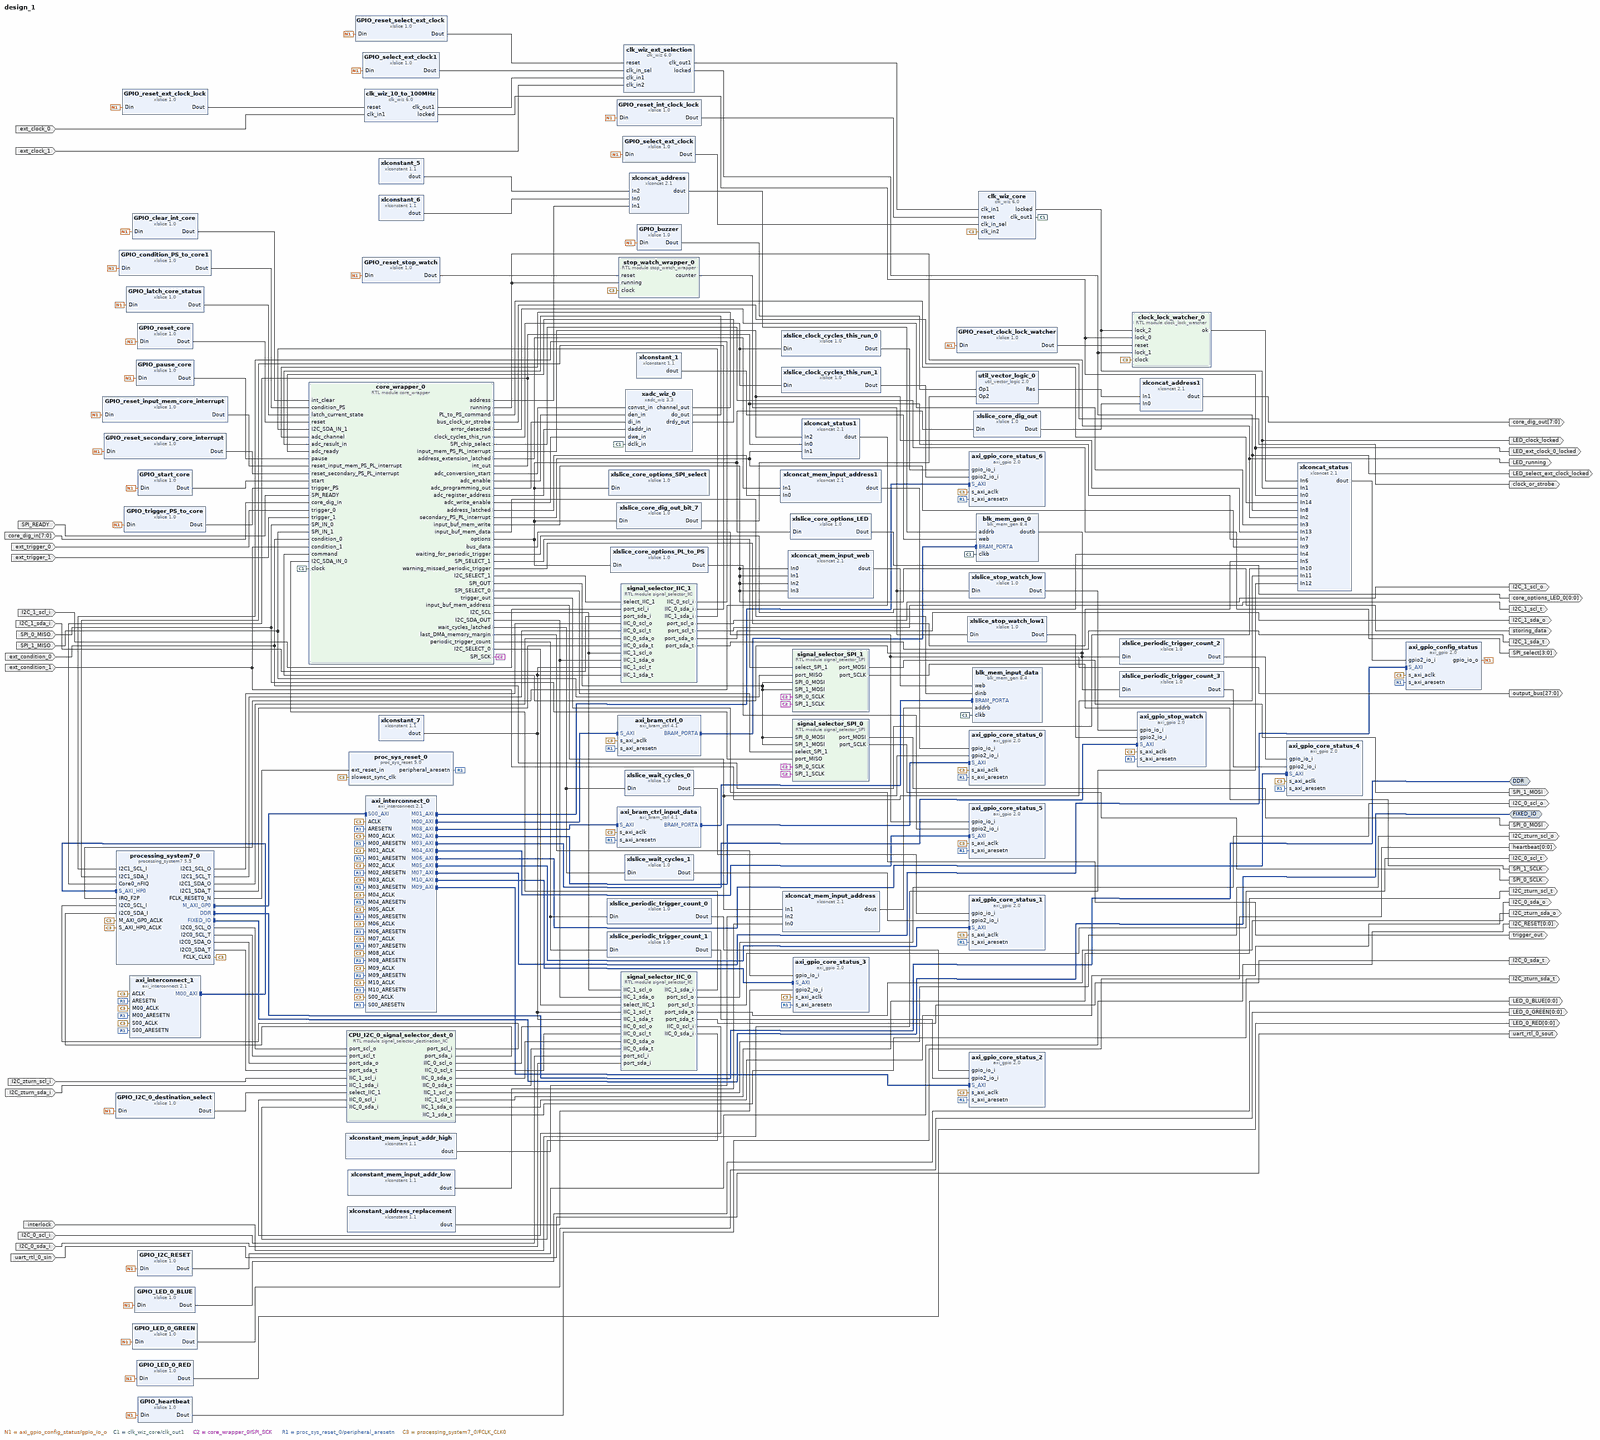
[diagram p0: block diagram of the top level, whole]
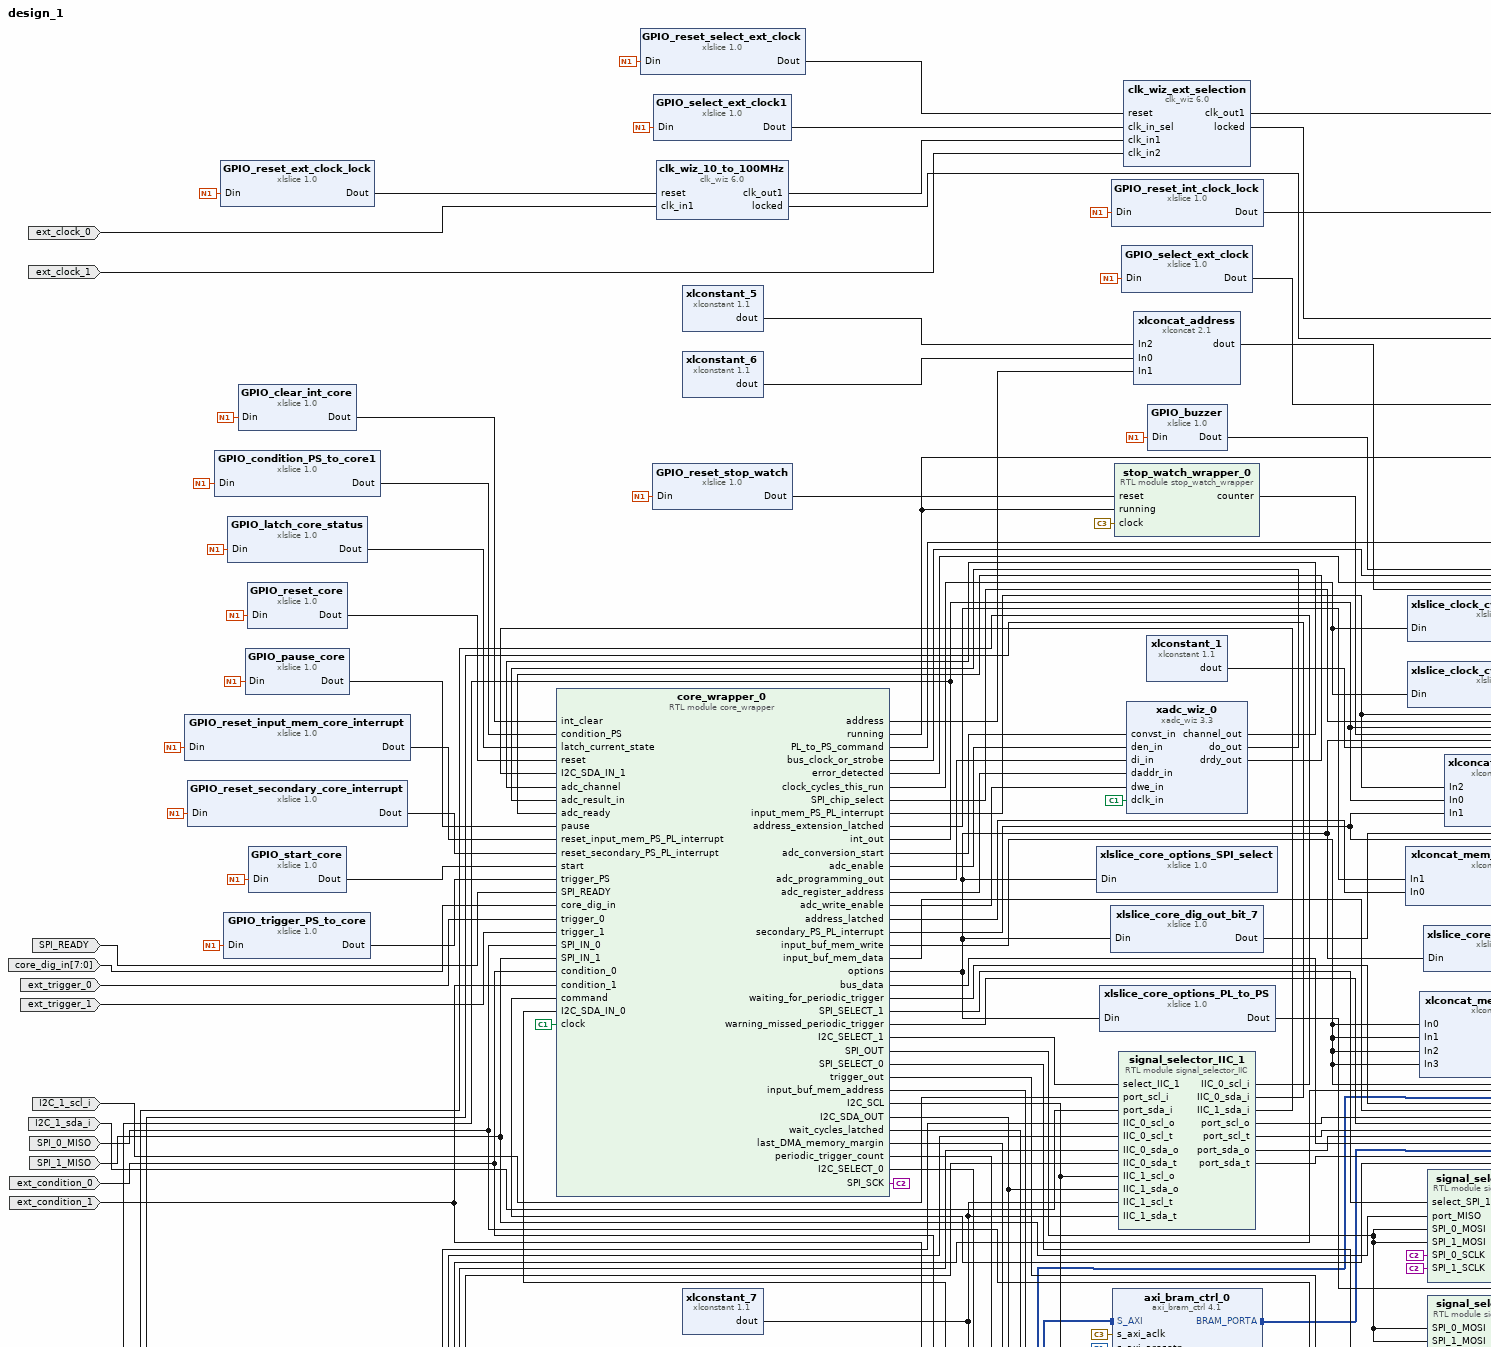
[diagram p1: block diagram of the top level, upper left part]
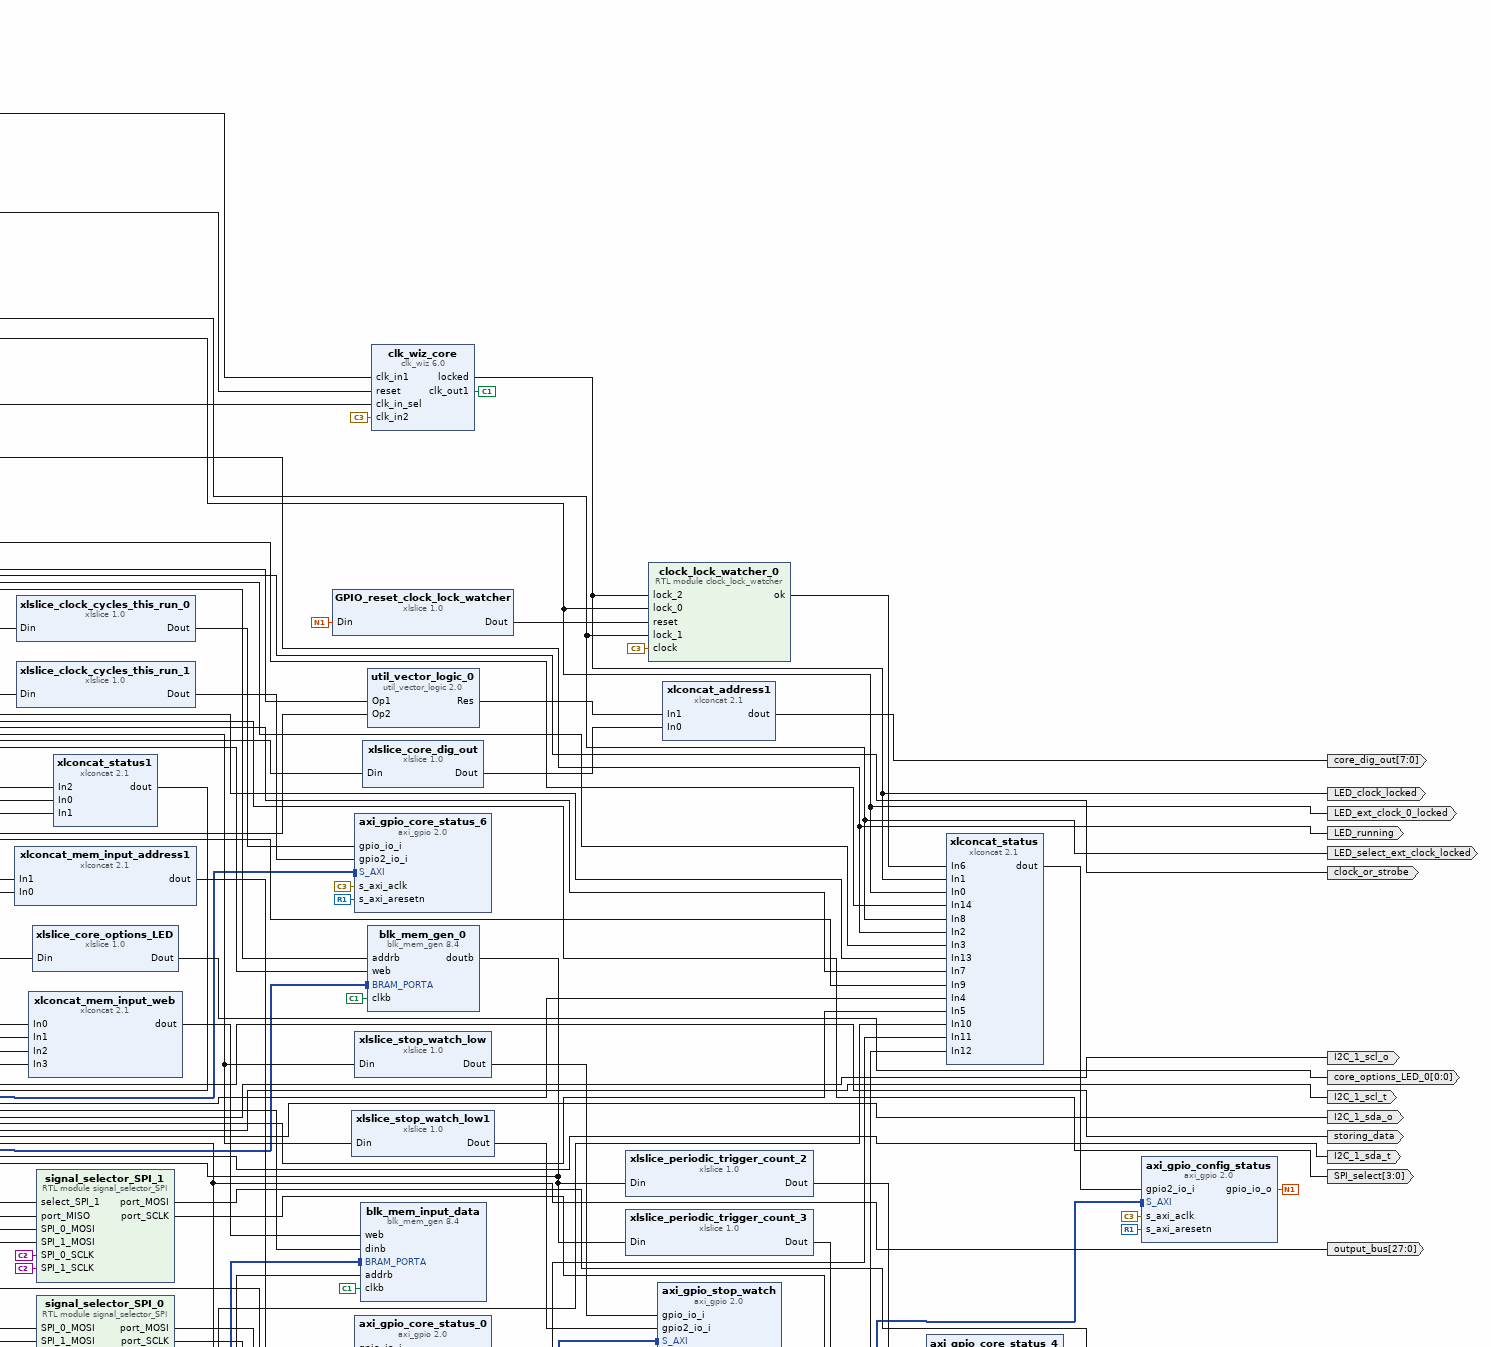
[diagram p2: block diagram of the top level, upper right part]
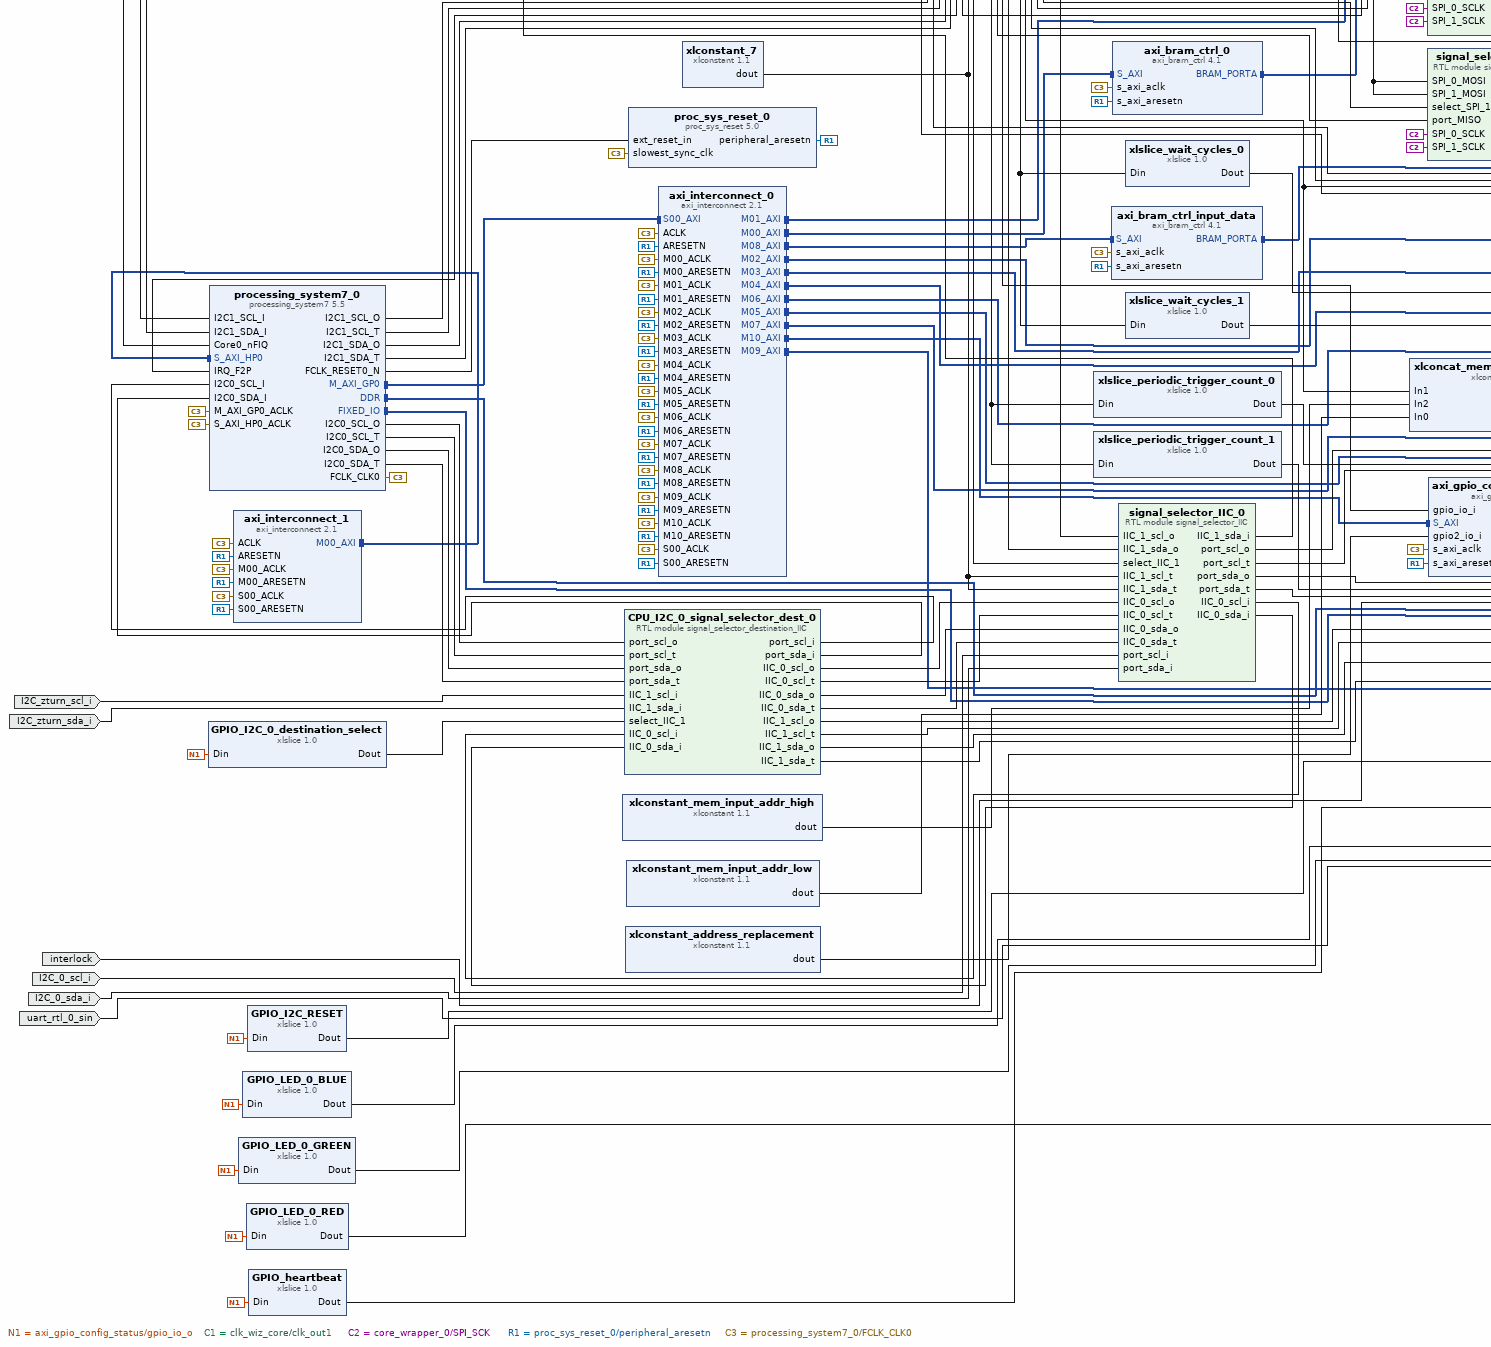
[diagram p3: block diagram of the top level, lower left part]
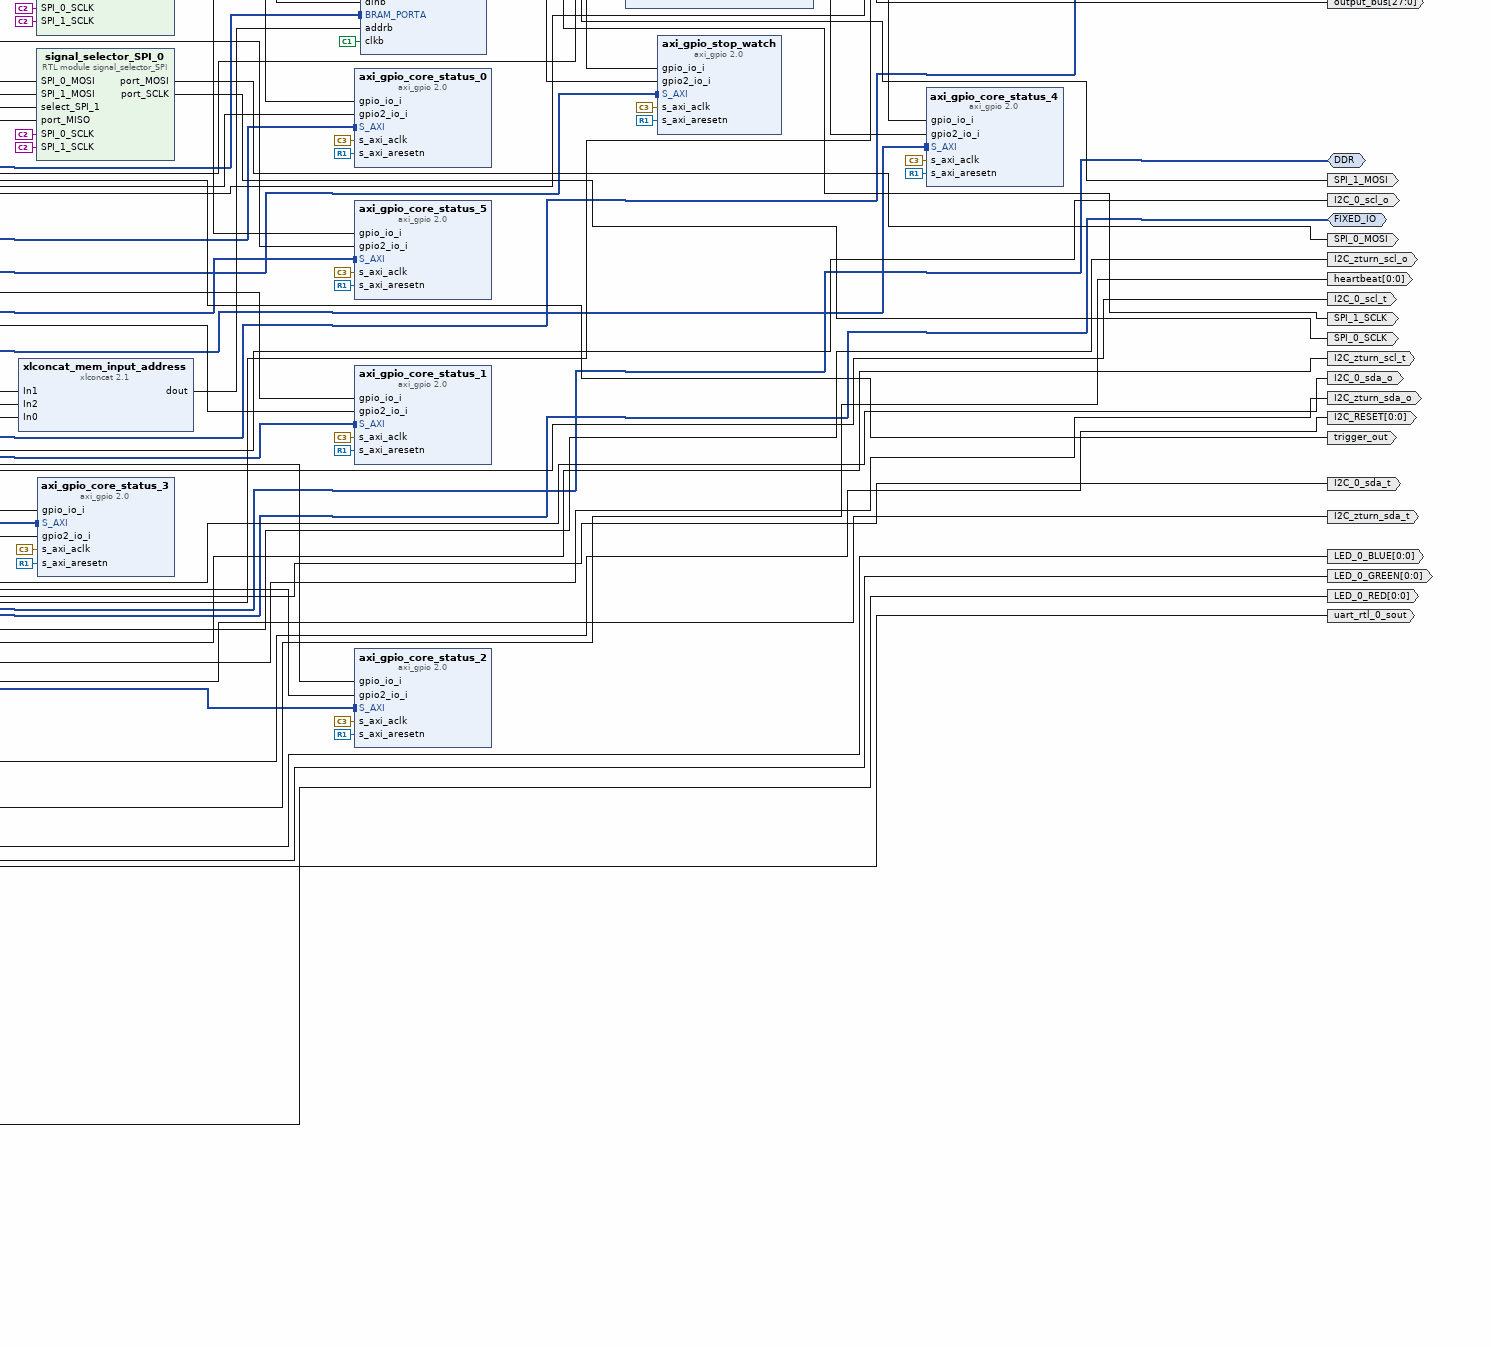
[diagram p4: block diagram of the top level, lower right part]
# Vivado block design design_1, xc7z020clg400-1, Vivado 2023.1
create_bd_design design_1

create_bd_intf_port -mode Master -vlnv xilinx.com:interface:ddrx_rtl:1.0 DDR
create_bd_intf_port -mode Master -vlnv xilinx.com:display_processing_system7:fixedio_rtl:1.0 FIXED_IO
create_bd_port -dir O -from 27 -to 0 output_bus
create_bd_port -dir O clock_or_strobe
create_bd_port -dir I ext_clock_0
create_bd_port -dir I ext_trigger_0
create_bd_port -dir I ext_trigger_1
create_bd_port -dir I ext_condition_0
create_bd_port -dir I ext_condition_1
create_bd_port -dir O I2C_1_scl_o
create_bd_port -dir O I2C_1_scl_t
create_bd_port -dir I I2C_1_scl_i
create_bd_port -dir O I2C_1_sda_o
create_bd_port -dir O I2C_1_sda_t
create_bd_port -dir I I2C_1_sda_i
create_bd_port -dir O I2C_0_scl_o
create_bd_port -dir O I2C_0_scl_t
create_bd_port -dir I I2C_0_scl_i
create_bd_port -dir O I2C_0_sda_o
create_bd_port -dir O I2C_0_sda_t
create_bd_port -dir I I2C_0_sda_i
create_bd_port -dir O SPI_0_MOSI
create_bd_port -dir O SPI_0_SCLK
create_bd_port -dir I SPI_0_MISO
create_bd_port -dir I SPI_1_MISO
create_bd_port -dir O SPI_1_MOSI
create_bd_port -dir O SPI_1_SCLK
create_bd_port -dir O LED_running
create_bd_port -dir O LED_ext_clock_0_locked
create_bd_port -dir O LED_clock_locked
create_bd_port -dir O trigger_out
create_bd_port -dir O -from 3 -to 0 SPI_select
create_bd_port -dir O -from 0 -to 0 core_options_LED_0
create_bd_port -dir O -from 0 -to 0 LED_0_RED
create_bd_port -dir O -from 0 -to 0 LED_0_GREEN
create_bd_port -dir O -from 0 -to 0 LED_0_BLUE
create_bd_port -dir O -from 0 -to 0 I2C_RESET
create_bd_port -dir I -type clk ext_clock_1
set_property -dict [list \
  CONFIG.CLK_DOMAIN design_1_processing_system7_0_0_FCLK_CLK0 \
  CONFIG.FREQ_HZ 100000000 \
] [get_bd_ports ext_clock_1]
create_bd_port -dir O LED_select_ext_clock_locked
create_bd_port -dir I -from 7 -to 0 core_dig_in
create_bd_port -dir O -from 7 -to 0 core_dig_out
create_bd_port -dir I interlock
create_bd_port -dir O storing_data
create_bd_port -dir O uart_rtl_0_sout
create_bd_port -dir I uart_rtl_0_sin
create_bd_port -dir I SPI_READY
create_bd_port -dir O -from 0 -to 0 -type data heartbeat
create_bd_port -dir I -type data I2C_zturn_sda_i
create_bd_port -dir I -type data I2C_zturn_scl_i
create_bd_port -dir O -type data I2C_zturn_sda_t
create_bd_port -dir O I2C_zturn_scl_t
create_bd_port -dir O I2C_zturn_sda_o
create_bd_port -dir O I2C_zturn_scl_o

create_bd_cell -type ip -vlnv xilinx.com:ip:axi_interconnect:2.1 axi_interconnect_0
set_property -dict {CONFIG.NUM_MI 11} [get_bd_cells axi_interconnect_0]
create_bd_cell -type ip -vlnv xilinx.com:ip:blk_mem_gen:8.4 blk_mem_gen_0
set_property -dict [list \
  CONFIG.Assume_Synchronous_Clk false \
  CONFIG.Enable_32bit_Address true \
  CONFIG.Enable_A Use_ENA_Pin \
  CONFIG.Enable_B Always_Enabled \
  CONFIG.Memory_Type True_Dual_Port_RAM \
  CONFIG.Operating_Mode_B WRITE_FIRST \
  CONFIG.Read_Width_A 64 \
  CONFIG.Register_PortA_Output_of_Memory_Primitives false \
  CONFIG.Register_PortB_Output_of_Memory_Primitives false \
  CONFIG.Use_RSTA_Pin false \
  CONFIG.Use_RSTB_Pin false \
  CONFIG.Write_Depth_A 65536 \
  CONFIG.Write_Width_A 64 \
  CONFIG.use_bram_block Stand_Alone \
] [get_bd_cells blk_mem_gen_0]
create_bd_cell -type ip -vlnv xilinx.com:ip:axi_bram_ctrl:4.1 axi_bram_ctrl_0
set_property -dict {CONFIG.DATA_WIDTH 64 CONFIG.SINGLE_PORT_BRAM 1} [get_bd_cells axi_bram_ctrl_0]
create_bd_cell -type ip -vlnv xilinx.com:ip:xlconstant:1.1 xlconstant_1
set_property -dict {CONFIG.CONST_VAL 0 CONFIG.CONST_WIDTH 8} [get_bd_cells xlconstant_1]
create_bd_cell -type ip -vlnv xilinx.com:ip:xlslice:1.0 GPIO_reset_core
set_property -dict {CONFIG.DIN_FROM 3 CONFIG.DIN_TO 3 CONFIG.DIN_WIDTH 32} [get_bd_cells GPIO_reset_core]
create_bd_cell -type ip -vlnv xilinx.com:ip:xlslice:1.0 GPIO_start_core
set_property -dict {CONFIG.DIN_FROM 4 CONFIG.DIN_TO 4 CONFIG.DIN_WIDTH 32} [get_bd_cells GPIO_start_core]
create_bd_cell -type ip -vlnv xilinx.com:ip:xlslice:1.0 GPIO_clear_int_core
set_property -dict {CONFIG.DIN_FROM 6 CONFIG.DIN_TO 6 CONFIG.DIN_WIDTH 32} [get_bd_cells GPIO_clear_int_core]
create_bd_cell -type ip -vlnv xilinx.com:ip:xlslice:1.0 GPIO_pause_core
set_property -dict {CONFIG.DIN_FROM 5 CONFIG.DIN_TO 5 CONFIG.DIN_WIDTH 32} [get_bd_cells GPIO_pause_core]
create_bd_cell -type ip -vlnv xilinx.com:ip:xlslice:1.0 GPIO_reset_ext_clock_lock
set_property -dict {CONFIG.DIN_FROM 0 CONFIG.DIN_TO 0 CONFIG.DIN_WIDTH 32} [get_bd_cells GPIO_reset_ext_clock_lock]
create_bd_cell -type ip -vlnv xilinx.com:ip:xlslice:1.0 GPIO_reset_int_clock_lock
set_property -dict {CONFIG.DIN_FROM 1 CONFIG.DIN_TO 1 CONFIG.DIN_WIDTH 32} [get_bd_cells GPIO_reset_int_clock_lock]
create_bd_cell -type ip -vlnv xilinx.com:ip:xlslice:1.0 GPIO_select_ext_clock
set_property -dict {CONFIG.DIN_FROM 8 CONFIG.DIN_TO 8 CONFIG.DIN_WIDTH 32} [get_bd_cells GPIO_select_ext_clock]
create_bd_cell -type ip -vlnv xilinx.com:ip:xlconcat:2.1 xlconcat_status
set_property -dict [list \
  CONFIG.IN0_WIDTH 1 \
  CONFIG.IN10_WIDTH 1 \
  CONFIG.IN11_WIDTH 1 \
  CONFIG.IN12_WIDTH 1 \
  CONFIG.IN13_WIDTH 1 \
  CONFIG.IN14_WIDTH 16 \
  CONFIG.IN1_WIDTH 1 \
  CONFIG.IN2_WIDTH 1 \
  CONFIG.IN3_WIDTH 1 \
  CONFIG.IN4_WIDTH 1 \
  CONFIG.IN5_WIDTH 1 \
  CONFIG.IN6_WIDTH 3 \
  CONFIG.IN7_WIDTH 1 \
  CONFIG.IN8_WIDTH 1 \
  CONFIG.IN9_WIDTH 1 \
  CONFIG.NUM_PORTS 15 \
] [get_bd_cells xlconcat_status]
create_bd_cell -type ip -vlnv xilinx.com:ip:xlslice:1.0 GPIO_latch_core_status
set_property -dict {CONFIG.DIN_FROM 7 CONFIG.DIN_TO 7 CONFIG.DIN_WIDTH 32} [get_bd_cells GPIO_latch_core_status]
create_bd_cell -type ip -vlnv xilinx.com:ip:xlslice:1.0 xlslice_wait_cycles_0
set_property -dict {CONFIG.DIN_FROM 31 CONFIG.DIN_TO 0 CONFIG.DIN_WIDTH 48} [get_bd_cells xlslice_wait_cycles_0]
create_bd_cell -type ip -vlnv xilinx.com:ip:xlslice:1.0 xlslice_wait_cycles_1
set_property -dict {CONFIG.DIN_FROM 47 CONFIG.DIN_TO 32 CONFIG.DIN_WIDTH 48} [get_bd_cells xlslice_wait_cycles_1]
create_bd_cell -type ip -vlnv xilinx.com:ip:blk_mem_gen:8.4 blk_mem_input_data
set_property -dict [list \
  CONFIG.Enable_32bit_Address true \
  CONFIG.Enable_B Always_Enabled \
  CONFIG.Memory_Type True_Dual_Port_RAM \
  CONFIG.Register_PortA_Output_of_Memory_Primitives false \
  CONFIG.Register_PortB_Output_of_Memory_Primitives false \
  CONFIG.Use_RSTA_Pin false \
  CONFIG.Use_RSTB_Pin false \
  CONFIG.Write_Depth_A 8192 \
  CONFIG.use_bram_block Stand_Alone \
] [get_bd_cells blk_mem_input_data]
create_bd_cell -type ip -vlnv xilinx.com:ip:axi_bram_ctrl:4.1 axi_bram_ctrl_input_data
set_property -dict {CONFIG.SINGLE_PORT_BRAM 1} [get_bd_cells axi_bram_ctrl_input_data]
create_bd_cell -type ip -vlnv xilinx.com:ip:xlslice:1.0 xlslice_periodic_trigger_count_0
set_property -dict {CONFIG.DIN_FROM 31 CONFIG.DIN_TO 0 CONFIG.DIN_WIDTH 48} [get_bd_cells xlslice_periodic_trigger_count_0]
create_bd_cell -type ip -vlnv xilinx.com:ip:xlslice:1.0 xlslice_periodic_trigger_count_1
set_property -dict {CONFIG.DIN_FROM 47 CONFIG.DIN_TO 32 CONFIG.DIN_WIDTH 48} [get_bd_cells xlslice_periodic_trigger_count_1]
create_bd_cell -type ip -vlnv xilinx.com:ip:xlslice:1.0 GPIO_reset_clock_lock_watcher
set_property -dict {CONFIG.DIN_FROM 2 CONFIG.DIN_TO 2 CONFIG.DIN_WIDTH 32} [get_bd_cells GPIO_reset_clock_lock_watcher]
create_bd_cell -type ip -vlnv xilinx.com:ip:xlconcat:2.1 xlconcat_address
set_property -dict [list \
  CONFIG.IN0_WIDTH 3 \
  CONFIG.IN1_WIDTH 16 \
  CONFIG.IN2_WIDTH 13 \
  CONFIG.IN3_WIDTH 54 \
  CONFIG.NUM_PORTS 3 \
] [get_bd_cells xlconcat_address]
create_bd_cell -type ip -vlnv xilinx.com:ip:xlconstant:1.1 xlconstant_5
set_property -dict {CONFIG.CONST_VAL 0 CONFIG.CONST_WIDTH 13} [get_bd_cells xlconstant_5]
create_bd_cell -type ip -vlnv xilinx.com:ip:xlconstant:1.1 xlconstant_6
set_property -dict {CONFIG.CONST_VAL 0 CONFIG.CONST_WIDTH 3} [get_bd_cells xlconstant_6]
create_bd_cell -type ip -vlnv xilinx.com:ip:xlslice:1.0 xlslice_periodic_trigger_count_2
set_property -dict {CONFIG.DIN_FROM 31 CONFIG.DIN_TO 0 CONFIG.DIN_WIDTH 64} [get_bd_cells xlslice_periodic_trigger_count_2]
create_bd_cell -type ip -vlnv xilinx.com:ip:xlslice:1.0 xlslice_periodic_trigger_count_3
set_property -dict {CONFIG.DIN_FROM 63 CONFIG.DIN_TO 32 CONFIG.DIN_WIDTH 64} [get_bd_cells xlslice_periodic_trigger_count_3]
create_bd_cell -type ip -vlnv xilinx.com:ip:xlslice:1.0 xlslice_clock_cycles_this_run_0
set_property -dict {CONFIG.DIN_FROM 31 CONFIG.DIN_TO 0 CONFIG.DIN_WIDTH 48} [get_bd_cells xlslice_clock_cycles_this_run_0]
create_bd_cell -type ip -vlnv xilinx.com:ip:xlslice:1.0 xlslice_clock_cycles_this_run_1
set_property -dict {CONFIG.DIN_FROM 47 CONFIG.DIN_TO 32 CONFIG.DIN_WIDTH 48} [get_bd_cells xlslice_clock_cycles_this_run_1]
create_bd_cell -type ip -vlnv xilinx.com:ip:xlslice:1.0 xlslice_core_options_PL_to_PS
set_property -dict {CONFIG.DIN_FROM 31 CONFIG.DIN_TO 24 CONFIG.DIN_WIDTH 32} [get_bd_cells xlslice_core_options_PL_to_PS]
create_bd_cell -type ip -vlnv xilinx.com:ip:xlslice:1.0 GPIO_trigger_PS_to_core
set_property -dict {CONFIG.DIN_FROM 9 CONFIG.DIN_TO 9 CONFIG.DIN_WIDTH 32} [get_bd_cells GPIO_trigger_PS_to_core]
create_bd_cell -type ip -vlnv xilinx.com:ip:xlslice:1.0 GPIO_condition_PS_to_core1
set_property -dict {CONFIG.DIN_FROM 10 CONFIG.DIN_TO 10 CONFIG.DIN_WIDTH 32} [get_bd_cells GPIO_condition_PS_to_core1]
create_bd_cell -type module -reference stop_watch_wrapper stop_watch_wrapper_0
create_bd_cell -type ip -vlnv xilinx.com:ip:xlslice:1.0 GPIO_reset_stop_watch
set_property -dict {CONFIG.DIN_FROM 11 CONFIG.DIN_TO 11 CONFIG.DIN_WIDTH 32} [get_bd_cells GPIO_reset_stop_watch]
create_bd_cell -type ip -vlnv xilinx.com:ip:xlslice:1.0 xlslice_stop_watch_low
set_property -dict {CONFIG.DIN_FROM 31 CONFIG.DIN_TO 0 CONFIG.DIN_WIDTH 48} [get_bd_cells xlslice_stop_watch_low]
create_bd_cell -type ip -vlnv xilinx.com:ip:xlslice:1.0 xlslice_stop_watch_low1
set_property -dict {CONFIG.DIN_FROM 47 CONFIG.DIN_TO 32 CONFIG.DIN_WIDTH 48} [get_bd_cells xlslice_stop_watch_low1]
create_bd_cell -type ip -vlnv xilinx.com:ip:xlslice:1.0 GPIO_LED_0_RED
set_property -dict {CONFIG.DIN_FROM 12 CONFIG.DIN_TO 12 CONFIG.DIN_WIDTH 32} [get_bd_cells GPIO_LED_0_RED]
create_bd_cell -type ip -vlnv xilinx.com:ip:xlslice:1.0 GPIO_LED_0_GREEN
set_property -dict {CONFIG.DIN_FROM 13 CONFIG.DIN_TO 13 CONFIG.DIN_WIDTH 32} [get_bd_cells GPIO_LED_0_GREEN]
create_bd_cell -type ip -vlnv xilinx.com:ip:xlslice:1.0 GPIO_LED_0_BLUE
set_property -dict {CONFIG.DIN_FROM 14 CONFIG.DIN_TO 14 CONFIG.DIN_WIDTH 32} [get_bd_cells GPIO_LED_0_BLUE]
create_bd_cell -type ip -vlnv xilinx.com:ip:xlslice:1.0 xlslice_core_options_LED
set_property -dict {CONFIG.DIN_FROM 0 CONFIG.DIN_TO 0 CONFIG.DIN_WIDTH 32} [get_bd_cells xlslice_core_options_LED]
create_bd_cell -type ip -vlnv xilinx.com:ip:xlslice:1.0 GPIO_I2C_RESET
set_property -dict {CONFIG.DIN_FROM 15 CONFIG.DIN_TO 15 CONFIG.DIN_WIDTH 32} [get_bd_cells GPIO_I2C_RESET]
create_bd_cell -type ip -vlnv xilinx.com:ip:xlslice:1.0 xlslice_core_options_SPI_select
set_property -dict {CONFIG.DIN_FROM 4 CONFIG.DIN_TO 1 CONFIG.DIN_WIDTH 32} [get_bd_cells xlslice_core_options_SPI_select]
create_bd_cell -type ip -vlnv xilinx.com:ip:xlconstant:1.1 xlconstant_7
set_property -dict {CONFIG.CONST_VAL 0 CONFIG.CONST_WIDTH 1} [get_bd_cells xlconstant_7]
create_bd_cell -type ip -vlnv xilinx.com:ip:xlslice:1.0 GPIO_select_ext_clock1
set_property -dict {CONFIG.DIN_FROM 16 CONFIG.DIN_TO 16 CONFIG.DIN_WIDTH 32} [get_bd_cells GPIO_select_ext_clock1]
create_bd_cell -type ip -vlnv xilinx.com:ip:xlslice:1.0 GPIO_reset_select_ext_clock
set_property -dict {CONFIG.DIN_FROM 17 CONFIG.DIN_TO 17 CONFIG.DIN_WIDTH 32} [get_bd_cells GPIO_reset_select_ext_clock]
create_bd_cell -type ip -vlnv xilinx.com:ip:xlslice:1.0 xlslice_core_dig_out
set_property -dict [list \
  CONFIG.DIN_FROM 14 \
  CONFIG.DIN_TO 8 \
  CONFIG.DIN_WIDTH 32 \
  CONFIG.DOUT_WIDTH 7 \
] [get_bd_cells xlslice_core_dig_out]
create_bd_cell -type ip -vlnv xilinx.com:ip:xlslice:1.0 GPIO_reset_secondary_core_interrupt
set_property -dict {CONFIG.DIN_FROM 18 CONFIG.DIN_TO 18 CONFIG.DIN_WIDTH 32} [get_bd_cells GPIO_reset_secondary_core_interrupt]
create_bd_cell -type ip -vlnv xilinx.com:ip:xadc_wiz:3.3 xadc_wiz_0
set_property -dict [list \
  CONFIG.ENABLE_RESET false \
  CONFIG.ENABLE_VCCDDRO_ALARM false \
  CONFIG.ENABLE_VCCPAUX_ALARM false \
  CONFIG.ENABLE_VCCPINT_ALARM false \
  CONFIG.INTERFACE_SELECTION ENABLE_DRP \
  CONFIG.OT_ALARM false \
  CONFIG.SINGLE_CHANNEL_SELECTION VP_VN \
  CONFIG.TIMING_MODE Event \
  CONFIG.USER_TEMP_ALARM false \
  CONFIG.VCCAUX_ALARM false \
  CONFIG.VCCINT_ALARM false \
] [get_bd_cells xadc_wiz_0]
create_bd_cell -type ip -vlnv xilinx.com:ip:xlconstant:1.1 xlconstant_mem_input_addr_low
set_property -dict {CONFIG.CONST_VAL 0 CONFIG.CONST_WIDTH 2} [get_bd_cells xlconstant_mem_input_addr_low]
create_bd_cell -type ip -vlnv xilinx.com:ip:xlconcat:2.1 xlconcat_mem_input_address
set_property -dict [list \
  CONFIG.IN0_WIDTH 2 \
  CONFIG.IN10_WIDTH 20 \
  CONFIG.IN1_WIDTH 13 \
  CONFIG.IN2_WIDTH 17 \
  CONFIG.IN3_WIDTH 1 \
  CONFIG.IN4_WIDTH 1 \
  CONFIG.IN5_WIDTH 1 \
  CONFIG.IN6_WIDTH 3 \
  CONFIG.IN7_WIDTH 1 \
  CONFIG.IN8_WIDTH 1 \
  CONFIG.IN9_WIDTH 1 \
  CONFIG.NUM_PORTS 3 \
] [get_bd_cells xlconcat_mem_input_address]
create_bd_cell -type ip -vlnv xilinx.com:ip:xlconcat:2.1 xlconcat_status1
set_property -dict [list \
  CONFIG.IN0_WIDTH 1 \
  CONFIG.IN1_WIDTH 1 \
  CONFIG.IN2_WIDTH 1 \
  CONFIG.IN3_WIDTH 1 \
  CONFIG.IN4_WIDTH 1 \
  CONFIG.IN5_WIDTH 1 \
  CONFIG.IN6_WIDTH 3 \
  CONFIG.IN7_WIDTH 1 \
  CONFIG.IN8_WIDTH 1 \
  CONFIG.IN9_WIDTH 21 \
  CONFIG.NUM_PORTS 3 \
] [get_bd_cells xlconcat_status1]
create_bd_cell -type ip -vlnv xilinx.com:ip:xlslice:1.0 GPIO_reset_input_mem_core_interrupt
set_property -dict {CONFIG.DIN_FROM 19 CONFIG.DIN_TO 19 CONFIG.DIN_WIDTH 32} [get_bd_cells GPIO_reset_input_mem_core_interrupt]
create_bd_cell -type ip -vlnv xilinx.com:ip:xlconcat:2.1 xlconcat_mem_input_address1
set_property -dict [list \
  CONFIG.IN0_WIDTH 16 \
  CONFIG.IN10_WIDTH 20 \
  CONFIG.IN1_WIDTH 13 \
  CONFIG.IN2_WIDTH 1 \
  CONFIG.IN3_WIDTH 1 \
  CONFIG.IN4_WIDTH 1 \
  CONFIG.IN5_WIDTH 1 \
  CONFIG.IN6_WIDTH 3 \
  CONFIG.IN7_WIDTH 1 \
  CONFIG.IN8_WIDTH 1 \
  CONFIG.IN9_WIDTH 1 \
  CONFIG.NUM_PORTS 2 \
] [get_bd_cells xlconcat_mem_input_address1]
create_bd_cell -type module -reference signal_selector_SPI signal_selector_SPI_0
create_bd_cell -type module -reference signal_selector_SPI signal_selector_SPI_1
create_bd_cell -type module -reference clock_lock_watcher clock_lock_watcher_0
create_bd_cell -type ip -vlnv xilinx.com:ip:xlconstant:1.1 xlconstant_mem_input_addr_high
set_property -dict {CONFIG.CONST_VAL 0 CONFIG.CONST_WIDTH 17} [get_bd_cells xlconstant_mem_input_addr_high]
create_bd_cell -type ip -vlnv xilinx.com:ip:xlconcat:2.1 xlconcat_mem_input_web
set_property -dict [list \
  CONFIG.IN0_WIDTH 1 \
  CONFIG.IN10_WIDTH 20 \
  CONFIG.IN1_WIDTH 1 \
  CONFIG.IN2_WIDTH 1 \
  CONFIG.IN3_WIDTH 1 \
  CONFIG.IN4_WIDTH 1 \
  CONFIG.IN5_WIDTH 1 \
  CONFIG.IN6_WIDTH 3 \
  CONFIG.IN7_WIDTH 1 \
  CONFIG.IN8_WIDTH 1 \
  CONFIG.IN9_WIDTH 1 \
  CONFIG.NUM_PORTS 4 \
] [get_bd_cells xlconcat_mem_input_web]
create_bd_cell -type ip -vlnv xilinx.com:ip:axi_gpio:2.0 axi_gpio_core_status_0
set_property -dict [list \
  CONFIG.C_ALL_INPUTS 1 \
  CONFIG.C_ALL_INPUTS_2 1 \
  CONFIG.C_GPIO2_WIDTH 13 \
  CONFIG.C_GPIO_WIDTH 29 \
  CONFIG.C_IS_DUAL 1 \
] [get_bd_cells axi_gpio_core_status_0]
create_bd_cell -type ip -vlnv xilinx.com:ip:axi_gpio:2.0 axi_gpio_core_status_1
set_property -dict [list \
  CONFIG.C_ALL_INPUTS 1 \
  CONFIG.C_ALL_INPUTS_2 1 \
  CONFIG.C_GPIO2_WIDTH 16 \
  CONFIG.C_GPIO_WIDTH 32 \
  CONFIG.C_IS_DUAL 1 \
] [get_bd_cells axi_gpio_core_status_1]
create_bd_cell -type ip -vlnv xilinx.com:ip:axi_gpio:2.0 axi_gpio_config_status
set_property -dict {CONFIG.C_ALL_INPUTS_2 1 CONFIG.C_ALL_OUTPUTS 1 CONFIG.C_IS_DUAL 1} [get_bd_cells axi_gpio_config_status]
create_bd_cell -type ip -vlnv xilinx.com:ip:axi_gpio:2.0 axi_gpio_core_status_2
set_property -dict [list \
  CONFIG.C_ALL_INPUTS 1 \
  CONFIG.C_ALL_INPUTS_2 1 \
  CONFIG.C_GPIO2_WIDTH 16 \
  CONFIG.C_GPIO_WIDTH 32 \
  CONFIG.C_IS_DUAL 1 \
] [get_bd_cells axi_gpio_core_status_2]
create_bd_cell -type ip -vlnv xilinx.com:ip:axi_gpio:2.0 axi_gpio_core_status_3
set_property -dict [list \
  CONFIG.C_ALL_INPUTS 1 \
  CONFIG.C_ALL_INPUTS_2 1 \
  CONFIG.C_GPIO2_WIDTH 16 \
  CONFIG.C_GPIO_WIDTH 16 \
  CONFIG.C_IS_DUAL 1 \
] [get_bd_cells axi_gpio_core_status_3]
create_bd_cell -type ip -vlnv xilinx.com:ip:axi_gpio:2.0 axi_gpio_core_status_4
set_property -dict [list \
  CONFIG.C_ALL_INPUTS 1 \
  CONFIG.C_ALL_INPUTS_2 1 \
  CONFIG.C_GPIO2_WIDTH 32 \
  CONFIG.C_GPIO_WIDTH 32 \
  CONFIG.C_IS_DUAL 1 \
] [get_bd_cells axi_gpio_core_status_4]
create_bd_cell -type ip -vlnv xilinx.com:ip:axi_gpio:2.0 axi_gpio_core_status_5
set_property -dict [list \
  CONFIG.C_ALL_INPUTS 1 \
  CONFIG.C_ALL_INPUTS_2 1 \
  CONFIG.C_GPIO2_WIDTH 8 \
  CONFIG.C_GPIO_WIDTH 28 \
  CONFIG.C_IS_DUAL 1 \
] [get_bd_cells axi_gpio_core_status_5]
create_bd_cell -type ip -vlnv xilinx.com:ip:axi_gpio:2.0 axi_gpio_core_status_6
set_property -dict [list \
  CONFIG.C_ALL_INPUTS 1 \
  CONFIG.C_ALL_INPUTS_2 1 \
  CONFIG.C_GPIO2_WIDTH 16 \
  CONFIG.C_GPIO_WIDTH 32 \
  CONFIG.C_IS_DUAL 1 \
] [get_bd_cells axi_gpio_core_status_6]
create_bd_cell -type ip -vlnv xilinx.com:ip:axi_gpio:2.0 axi_gpio_stop_watch
set_property -dict [list \
  CONFIG.C_ALL_INPUTS 1 \
  CONFIG.C_ALL_INPUTS_2 1 \
  CONFIG.C_GPIO2_WIDTH 16 \
  CONFIG.C_GPIO_WIDTH 32 \
  CONFIG.C_IS_DUAL 1 \
] [get_bd_cells axi_gpio_stop_watch]
create_bd_cell -type ip -vlnv xilinx.com:ip:clk_wiz:6.0 clk_wiz_10_to_100MHz
set_property -dict [list \
  CONFIG.CLKIN1_JITTER_PS 1000.0 \
  CONFIG.CLKIN2_JITTER_PS 1000.0 \
  CONFIG.CLKOUT1_JITTER 637.214 \
  CONFIG.CLKOUT1_PHASE_ERROR 892.144 \
  CONFIG.JITTER_SEL Min_O_Jitter \
  CONFIG.MMCM_BANDWIDTH HIGH \
  CONFIG.MMCM_CLKFBOUT_MULT_F 63.750 \
  CONFIG.MMCM_CLKIN1_PERIOD 100.000 \
  CONFIG.MMCM_CLKIN2_PERIOD 10.0 \
  CONFIG.MMCM_CLKOUT0_DIVIDE_F 6.375 \
  CONFIG.PRIM_IN_FREQ 10.000 \
  CONFIG.SECONDARY_IN_FREQ 100.000 \
  CONFIG.SECONDARY_SOURCE Single_ended_clock_capable_pin \
  CONFIG.USE_INCLK_SWITCHOVER false \
] [get_bd_cells clk_wiz_10_to_100MHz]
create_bd_cell -type ip -vlnv xilinx.com:ip:clk_wiz:6.0 clk_wiz_core
set_property -dict [list \
  CONFIG.CLKIN2_JITTER_PS 100.0 \
  CONFIG.CLKOUT1_DRIVES BUFG \
  CONFIG.CLKOUT1_JITTER 96.283 \
  CONFIG.CLKOUT1_PHASE_ERROR 76.967 \
  CONFIG.CLKOUT2_DRIVES BUFG \
  CONFIG.CLKOUT3_DRIVES BUFG \
  CONFIG.CLKOUT4_DRIVES BUFG \
  CONFIG.CLKOUT5_DRIVES BUFG \
  CONFIG.CLKOUT6_DRIVES BUFG \
  CONFIG.CLKOUT7_DRIVES BUFG \
  CONFIG.JITTER_SEL Min_O_Jitter \
  CONFIG.MMCM_BANDWIDTH HIGH \
  CONFIG.MMCM_CLKFBOUT_MULT_F 15 \
  CONFIG.MMCM_CLKIN2_PERIOD 10.000 \
  CONFIG.MMCM_CLKOUT0_DIVIDE_F 15 \
  CONFIG.MMCM_COMPENSATION ZHOLD \
  CONFIG.PRIMITIVE PLL \
  CONFIG.PRIM_IN_FREQ 100.000 \
  CONFIG.PRIM_SOURCE Single_ended_clock_capable_pin \
  CONFIG.SECONDARY_IN_FREQ 100 \
  CONFIG.SECONDARY_SOURCE Single_ended_clock_capable_pin \
  CONFIG.USE_INCLK_SWITCHOVER true \
  CONFIG.USE_PHASE_ALIGNMENT false \
] [get_bd_cells clk_wiz_core]
create_bd_cell -type ip -vlnv xilinx.com:ip:clk_wiz:6.0 clk_wiz_ext_selection
set_property -dict [list \
  CONFIG.CLKIN2_JITTER_PS 100.0 \
  CONFIG.CLKOUT1_DRIVES BUFG \
  CONFIG.CLKOUT1_JITTER 96.283 \
  CONFIG.CLKOUT1_PHASE_ERROR 76.967 \
  CONFIG.CLKOUT2_DRIVES BUFG \
  CONFIG.CLKOUT3_DRIVES BUFG \
  CONFIG.CLKOUT4_DRIVES BUFG \
  CONFIG.CLKOUT5_DRIVES BUFG \
  CONFIG.CLKOUT6_DRIVES BUFG \
  CONFIG.CLKOUT7_DRIVES BUFG \
  CONFIG.JITTER_SEL Min_O_Jitter \
  CONFIG.MMCM_BANDWIDTH HIGH \
  CONFIG.MMCM_CLKFBOUT_MULT_F 15 \
  CONFIG.MMCM_CLKIN2_PERIOD 10.000 \
  CONFIG.MMCM_CLKOUT0_DIVIDE_F 15 \
  CONFIG.MMCM_COMPENSATION ZHOLD \
  CONFIG.PRIMITIVE PLL \
  CONFIG.PRIM_IN_FREQ 100.000 \
  CONFIG.PRIM_SOURCE Single_ended_clock_capable_pin \
  CONFIG.SECONDARY_IN_FREQ 100 \
  CONFIG.SECONDARY_SOURCE Single_ended_clock_capable_pin \
  CONFIG.USE_INCLK_SWITCHOVER true \
  CONFIG.USE_PHASE_ALIGNMENT false \
] [get_bd_cells clk_wiz_ext_selection]
create_bd_cell -type ip -vlnv xilinx.com:ip:proc_sys_reset:5.0 proc_sys_reset_0
create_bd_cell -type ip -vlnv xilinx.com:ip:processing_system7:5.5 processing_system7_0
set_property -dict [list \
  CONFIG.PCW_APU_PERIPHERAL_FREQMHZ 666.666666 \
  CONFIG.PCW_CORE0_FIQ_INTR 1 \
  CONFIG.PCW_ENET0_ENET0_IO {MIO 16 .. 27} \
  CONFIG.PCW_ENET0_GRP_MDIO_ENABLE 1 \
  CONFIG.PCW_ENET0_GRP_MDIO_IO {MIO 52 .. 53} \
  CONFIG.PCW_ENET0_PERIPHERAL_ENABLE 1 \
  CONFIG.PCW_ENET_RESET_ENABLE 0 \
  CONFIG.PCW_FPGA0_PERIPHERAL_FREQMHZ 100 \
  CONFIG.PCW_FPGA1_PERIPHERAL_FREQMHZ 100 \
  CONFIG.PCW_FPGA2_PERIPHERAL_FREQMHZ 33.333333 \
  CONFIG.PCW_GPIO_EMIO_GPIO_ENABLE 1 \
  CONFIG.PCW_GPIO_EMIO_GPIO_IO 64 \
  CONFIG.PCW_GPIO_MIO_GPIO_ENABLE 1 \
  CONFIG.PCW_GPIO_MIO_GPIO_IO MIO \
  CONFIG.PCW_GPIO_PERIPHERAL_ENABLE 1 \
  CONFIG.PCW_I2C0_I2C0_IO EMIO \
  CONFIG.PCW_I2C0_PERIPHERAL_ENABLE 1 \
  CONFIG.PCW_I2C1_I2C1_IO EMIO \
  CONFIG.PCW_I2C1_PERIPHERAL_ENABLE 1 \
  CONFIG.PCW_I2C_PERIPHERAL_FREQMHZ 111.111115 \
  CONFIG.PCW_I2C_RESET_ENABLE 0 \
  CONFIG.PCW_IRQ_F2P_INTR 1 \
  CONFIG.PCW_PERIPHERAL_BOARD_PRESET part0 \
  CONFIG.PCW_PRESET_BANK1_VOLTAGE {LVCMOS 1.8V} \
  CONFIG.PCW_QSPI_GRP_FBCLK_ENABLE 1 \
  CONFIG.PCW_QSPI_GRP_FBCLK_IO {MIO 8} \
  CONFIG.PCW_QSPI_GRP_SINGLE_SS_ENABLE 1 \
  CONFIG.PCW_QSPI_GRP_SINGLE_SS_IO {MIO 1 .. 6} \
  CONFIG.PCW_QSPI_PERIPHERAL_ENABLE 1 \
  CONFIG.PCW_QSPI_QSPI_IO {MIO 1 .. 6} \
  CONFIG.PCW_SD0_GRP_CD_ENABLE 1 \
  CONFIG.PCW_SD0_GRP_CD_IO {MIO 46} \
  CONFIG.PCW_SD0_GRP_WP_ENABLE 1 \
  CONFIG.PCW_SD0_GRP_WP_IO {MIO 50} \
  CONFIG.PCW_SD0_PERIPHERAL_ENABLE 1 \
  CONFIG.PCW_SD0_SD0_IO {MIO 40 .. 45} \
  CONFIG.PCW_SDIO_PERIPHERAL_FREQMHZ 50 \
  CONFIG.PCW_SINGLE_QSPI_DATA_MODE x4 \
  CONFIG.PCW_TTC0_PERIPHERAL_ENABLE 1 \
  CONFIG.PCW_TTC0_TTC0_IO EMIO \
  CONFIG.PCW_UART1_PERIPHERAL_ENABLE 1 \
  CONFIG.PCW_UART1_UART1_IO {MIO 48 .. 49} \
  CONFIG.PCW_UART_PERIPHERAL_FREQMHZ 50 \
  CONFIG.PCW_UIPARAM_DDR_FREQ_MHZ 533.333313 \
  CONFIG.PCW_UIPARAM_DDR_PARTNO {MT41J256M16 RE-125} \
  CONFIG.PCW_USB0_PERIPHERAL_ENABLE 1 \
  CONFIG.PCW_USB0_USB0_IO {MIO 28 .. 39} \
  CONFIG.PCW_USB_RESET_ENABLE 0 \
  CONFIG.PCW_USE_FABRIC_INTERRUPT 1 \
  CONFIG.PCW_USE_S_AXI_HP0 1 \
  CONFIG.preset Default \
] [get_bd_cells processing_system7_0]
# 517 more settings of processing_system7_0 are not shown: defaults, MIO pin electricals, DDR timing, and values the tool derives
create_bd_cell -type ip -vlnv xilinx.com:ip:axi_interconnect:2.1 axi_interconnect_1
set_property -dict {CONFIG.NUM_MI 1} [get_bd_cells axi_interconnect_1]
create_bd_cell -type module -reference signal_selector_IIC signal_selector_IIC_0
create_bd_cell -type module -reference signal_selector_IIC signal_selector_IIC_1
create_bd_cell -type ip -vlnv xilinx.com:ip:xlconstant:1.1 xlconstant_address_replacement
set_property -dict {CONFIG.CONST_VAL 0 CONFIG.CONST_WIDTH 16} [get_bd_cells xlconstant_address_replacement]
create_bd_cell -type module -reference signal_selector_destination_IIC CPU_I2C_0_signal_selector_dest_0
create_bd_cell -type ip -vlnv xilinx.com:ip:xlslice:1.0 GPIO_I2C_0_destination_select
set_property -dict {CONFIG.DIN_FROM 21 CONFIG.DIN_TO 21 CONFIG.DIN_WIDTH 32} [get_bd_cells GPIO_I2C_0_destination_select]
create_bd_cell -type ip -vlnv xilinx.com:ip:xlslice:1.0 GPIO_buzzer
set_property -dict {CONFIG.DIN_FROM 24 CONFIG.DIN_TO 24 CONFIG.DIN_WIDTH 32} [get_bd_cells GPIO_buzzer]
create_bd_cell -type ip -vlnv xilinx.com:ip:util_vector_logic:2.0 util_vector_logic_0
set_property -dict {CONFIG.C_OPERATION or CONFIG.C_SIZE 1} [get_bd_cells util_vector_logic_0]
create_bd_cell -type ip -vlnv xilinx.com:ip:xlslice:1.0 xlslice_core_dig_out_bit_7
set_property -dict [list \
  CONFIG.DIN_FROM 15 \
  CONFIG.DIN_TO 15 \
  CONFIG.DIN_WIDTH 32 \
  CONFIG.DOUT_WIDTH 1 \
] [get_bd_cells xlslice_core_dig_out_bit_7]
create_bd_cell -type ip -vlnv xilinx.com:ip:xlconcat:2.1 xlconcat_address1
set_property -dict [list \
  CONFIG.IN0_WIDTH 7 \
  CONFIG.IN1_WIDTH 1 \
  CONFIG.IN2_WIDTH 13 \
  CONFIG.IN3_WIDTH 54 \
  CONFIG.NUM_PORTS 2 \
] [get_bd_cells xlconcat_address1]
create_bd_cell -type ip -vlnv xilinx.com:ip:xlslice:1.0 GPIO_heartbeat
set_property -dict {CONFIG.DIN_FROM 20 CONFIG.DIN_TO 20 CONFIG.DIN_WIDTH 32} [get_bd_cells GPIO_heartbeat]
create_bd_cell -type module -reference core_wrapper core_wrapper_0

# ---- connections ----

connect_bd_intf_net [get_bd_intf_pins blk_mem_gen_0/BRAM_PORTA] [get_bd_intf_pins axi_bram_ctrl_0/BRAM_PORTA]
connect_bd_intf_net -intf_net axi_bram_ctrl_1_BRAM_PORTA [get_bd_intf_pins axi_bram_ctrl_input_data/BRAM_PORTA] [get_bd_intf_pins blk_mem_input_data/BRAM_PORTA]
connect_bd_intf_net [get_bd_intf_pins axi_interconnect_0/M00_AXI] [get_bd_intf_pins axi_bram_ctrl_0/S_AXI]
connect_bd_intf_net [get_bd_intf_pins axi_interconnect_0/M01_AXI] [get_bd_intf_pins axi_gpio_core_status_6/S_AXI]
connect_bd_intf_net [get_bd_intf_pins axi_interconnect_0/M02_AXI] [get_bd_intf_pins axi_gpio_core_status_0/S_AXI]
connect_bd_intf_net [get_bd_intf_pins axi_interconnect_0/M03_AXI] [get_bd_intf_pins axi_gpio_stop_watch/S_AXI]
connect_bd_intf_net [get_bd_intf_pins axi_gpio_core_status_5/S_AXI] [get_bd_intf_pins axi_interconnect_0/M04_AXI]
connect_bd_intf_net [get_bd_intf_pins axi_interconnect_0/M05_AXI] [get_bd_intf_pins axi_gpio_core_status_1/S_AXI]
connect_bd_intf_net [get_bd_intf_pins axi_gpio_core_status_4/S_AXI] [get_bd_intf_pins axi_interconnect_0/M06_AXI]
connect_bd_intf_net [get_bd_intf_pins axi_interconnect_0/M07_AXI] [get_bd_intf_pins axi_gpio_config_status/S_AXI]
connect_bd_intf_net [get_bd_intf_pins axi_interconnect_0/M08_AXI] [get_bd_intf_pins axi_bram_ctrl_input_data/S_AXI]
connect_bd_intf_net [get_bd_intf_pins axi_interconnect_0/M09_AXI] [get_bd_intf_pins axi_gpio_core_status_2/S_AXI]
connect_bd_intf_net [get_bd_intf_pins axi_interconnect_0/M10_AXI] [get_bd_intf_pins axi_gpio_core_status_3/S_AXI]
connect_bd_intf_net [get_bd_intf_pins processing_system7_0/S_AXI_HP0] [get_bd_intf_pins axi_interconnect_1/M00_AXI]
connect_bd_intf_net [get_bd_intf_ports DDR] [get_bd_intf_pins processing_system7_0/DDR]
connect_bd_intf_net [get_bd_intf_ports FIXED_IO] [get_bd_intf_pins processing_system7_0/FIXED_IO]
connect_bd_intf_net [get_bd_intf_pins processing_system7_0/M_AXI_GP0] [get_bd_intf_pins axi_interconnect_0/S00_AXI]
connect_bd_net [get_bd_pins CPU_I2C_0_signal_selector_dest_0/IIC_1_scl_o] [get_bd_ports I2C_zturn_scl_o]
connect_bd_net [get_bd_pins CPU_I2C_0_signal_selector_dest_0/IIC_1_scl_t] [get_bd_ports I2C_zturn_scl_t]
connect_bd_net [get_bd_pins CPU_I2C_0_signal_selector_dest_0/IIC_1_sda_o] [get_bd_ports I2C_zturn_sda_o]
connect_bd_net [get_bd_pins CPU_I2C_0_signal_selector_dest_0/IIC_1_sda_t] [get_bd_ports I2C_zturn_sda_t]
connect_bd_net [get_bd_pins GPIO_I2C_0_destination_select/Dout] [get_bd_pins CPU_I2C_0_signal_selector_dest_0/select_IIC_1]
connect_bd_net [get_bd_pins GPIO_I2C_RESET/Dout] [get_bd_ports I2C_RESET]
connect_bd_net [get_bd_pins GPIO_LED_0_BLUE/Dout] [get_bd_ports LED_0_BLUE]
connect_bd_net [get_bd_pins GPIO_LED_0_GREEN/Dout] [get_bd_ports LED_0_GREEN]
connect_bd_net [get_bd_pins GPIO_LED_0_RED/Dout] [get_bd_ports LED_0_RED]
connect_bd_net [get_bd_pins GPIO_buzzer/Dout] [get_bd_pins util_vector_logic_0/Op1]
connect_bd_net [get_bd_pins GPIO_clear_int_core/Dout] [get_bd_pins core_wrapper_0/int_clear]
connect_bd_net [get_bd_pins GPIO_condition_PS_to_core1/Dout] [get_bd_pins core_wrapper_0/condition_PS]
connect_bd_net [get_bd_pins GPIO_heartbeat/Dout] [get_bd_ports heartbeat]
connect_bd_net -net GPIO_latch_core_status1_Dout [get_bd_pins GPIO_reset_clock_lock_watcher/Dout] [get_bd_pins clock_lock_watcher_0/reset]
connect_bd_net [get_bd_pins GPIO_latch_core_status/Dout] [get_bd_pins core_wrapper_0/latch_current_state]
connect_bd_net -net GPIO_output_low1_Dout [get_bd_pins GPIO_reset_core/Dout] [get_bd_pins core_wrapper_0/reset]
connect_bd_net [get_bd_pins GPIO_pause_core/Dout] [get_bd_pins core_wrapper_0/pause]
connect_bd_net -net GPIO_reset_ext_clock_lock [get_bd_pins GPIO_reset_ext_clock_lock/Dout] [get_bd_pins clk_wiz_10_to_100MHz/reset]
connect_bd_net [get_bd_pins GPIO_reset_input_mem_core_interrupt/Dout] [get_bd_pins core_wrapper_0/reset_input_mem_PS_PL_interrupt]
connect_bd_net [get_bd_pins GPIO_reset_int_clock_lock/Dout] [get_bd_pins clk_wiz_core/reset]
connect_bd_net [get_bd_pins GPIO_reset_secondary_core_interrupt/Dout] [get_bd_pins core_wrapper_0/reset_secondary_PS_PL_interrupt]
connect_bd_net [get_bd_pins GPIO_reset_select_ext_clock/Dout] [get_bd_pins clk_wiz_ext_selection/reset]
connect_bd_net [get_bd_pins GPIO_reset_stop_watch/Dout] [get_bd_pins stop_watch_wrapper_0/reset]
connect_bd_net [get_bd_pins GPIO_select_ext_clock1/Dout] [get_bd_pins clk_wiz_ext_selection/clk_in_sel]
connect_bd_net [get_bd_pins GPIO_select_ext_clock/Dout] [get_bd_pins clk_wiz_core/clk_in_sel]
connect_bd_net [get_bd_pins GPIO_start_core/Dout] [get_bd_pins core_wrapper_0/start]
connect_bd_net [get_bd_pins GPIO_trigger_PS_to_core/Dout] [get_bd_pins core_wrapper_0/trigger_PS]
connect_bd_net [get_bd_ports I2C_zturn_scl_i] [get_bd_pins CPU_I2C_0_signal_selector_dest_0/IIC_1_scl_i]
connect_bd_net [get_bd_ports I2C_zturn_sda_i] [get_bd_pins CPU_I2C_0_signal_selector_dest_0/IIC_1_sda_i]
connect_bd_net [get_bd_ports SPI_READY] [get_bd_pins core_wrapper_0/SPI_READY]
connect_bd_net [get_bd_pins axi_gpio_config_status/gpio_io_o] \
  [get_bd_pins GPIO_reset_core/Din] [get_bd_pins GPIO_start_core/Din] [get_bd_pins GPIO_clear_int_core/Din] \
  [get_bd_pins GPIO_pause_core/Din] [get_bd_pins GPIO_reset_int_clock_lock/Din] [get_bd_pins GPIO_reset_ext_clock_lock/Din] \
  [get_bd_pins GPIO_select_ext_clock/Din] [get_bd_pins GPIO_latch_core_status/Din] \
  [get_bd_pins GPIO_reset_clock_lock_watcher/Din] [get_bd_pins GPIO_trigger_PS_to_core/Din] \
  [get_bd_pins GPIO_condition_PS_to_core1/Din] [get_bd_pins GPIO_reset_stop_watch/Din] [get_bd_pins GPIO_LED_0_BLUE/Din] \
  [get_bd_pins GPIO_LED_0_GREEN/Din] [get_bd_pins GPIO_LED_0_RED/Din] [get_bd_pins GPIO_I2C_RESET/Din] \
  [get_bd_pins GPIO_select_ext_clock1/Din] [get_bd_pins GPIO_reset_select_ext_clock/Din] \
  [get_bd_pins GPIO_reset_secondary_core_interrupt/Din] [get_bd_pins GPIO_reset_input_mem_core_interrupt/Din] \
  [get_bd_pins GPIO_I2C_0_destination_select/Din] [get_bd_pins GPIO_buzzer/Din] [get_bd_pins GPIO_heartbeat/Din]
connect_bd_net [get_bd_pins blk_mem_gen_0/doutb] \
  [get_bd_pins xlslice_periodic_trigger_count_3/Din] [get_bd_pins xlslice_periodic_trigger_count_2/Din] \
  [get_bd_pins core_wrapper_0/command]
connect_bd_net [get_bd_pins clk_wiz_10_to_100MHz/clk_out1] [get_bd_pins clk_wiz_ext_selection/clk_in1]
connect_bd_net [get_bd_pins clk_wiz_10_to_100MHz/locked] \
  [get_bd_pins xlconcat_status/In0] [get_bd_ports LED_ext_clock_0_locked] [get_bd_pins clock_lock_watcher_0/lock_0]
connect_bd_net [get_bd_pins clk_wiz_core/clk_out1] \
  [get_bd_pins blk_mem_gen_0/clkb] [get_bd_pins blk_mem_input_data/clkb] [get_bd_pins xadc_wiz_0/dclk_in] \
  [get_bd_pins core_wrapper_0/clock]
connect_bd_net [get_bd_pins clk_wiz_core/locked] \
  [get_bd_pins xlconcat_status/In1] [get_bd_ports LED_clock_locked] [get_bd_pins clock_lock_watcher_0/lock_2]
connect_bd_net [get_bd_pins clk_wiz_ext_selection/clk_out1] [get_bd_pins clk_wiz_core/clk_in1]
connect_bd_net [get_bd_pins clk_wiz_ext_selection/locked] \
  [get_bd_ports LED_select_ext_clock_locked] [get_bd_pins xlconcat_status/In8] [get_bd_pins clock_lock_watcher_0/lock_1]
connect_bd_net [get_bd_pins clock_lock_watcher_0/ok] [get_bd_pins xlconcat_status/In6]
connect_bd_net -net core_0_periodic_trigger_count [get_bd_pins core_wrapper_0/periodic_trigger_count] \
  [get_bd_pins xlslice_periodic_trigger_count_0/Din] [get_bd_pins xlslice_periodic_trigger_count_1/Din]
connect_bd_net -net core_0_wait_cycles_latched [get_bd_pins core_wrapper_0/wait_cycles_latched] \
  [get_bd_pins xlslice_wait_cycles_0/Din] [get_bd_pins xlslice_wait_cycles_1/Din]
connect_bd_net [get_bd_ports core_dig_in] [get_bd_pins core_wrapper_0/core_dig_in]
connect_bd_net [get_bd_pins core_wrapper_0/I2C_SCL] [get_bd_pins signal_selector_IIC_0/IIC_1_scl_o] [get_bd_pins signal_selector_IIC_1/IIC_1_scl_o]
connect_bd_net -net core_wrapper_0_I2C_SDA [get_bd_pins core_wrapper_0/I2C_SDA_OUT] \
  [get_bd_pins signal_selector_IIC_0/IIC_1_sda_o] [get_bd_pins signal_selector_IIC_1/IIC_1_sda_o]
connect_bd_net [get_bd_pins core_wrapper_0/I2C_SELECT_0] [get_bd_pins signal_selector_IIC_0/select_IIC_1]
connect_bd_net [get_bd_pins core_wrapper_0/I2C_SELECT_1] [get_bd_pins signal_selector_IIC_1/select_IIC_1]
connect_bd_net [get_bd_pins core_wrapper_0/PL_to_PS_command] [get_bd_pins xlconcat_status/In14]
connect_bd_net [get_bd_pins core_wrapper_0/SPI_OUT] \
  [get_bd_pins signal_selector_SPI_0/SPI_1_MOSI] [get_bd_pins signal_selector_SPI_1/SPI_1_MOSI] \
  [get_bd_pins signal_selector_SPI_0/SPI_0_MOSI] [get_bd_pins signal_selector_SPI_1/SPI_0_MOSI]
connect_bd_net [get_bd_pins core_wrapper_0/SPI_SCK] \
  [get_bd_pins signal_selector_SPI_0/SPI_1_SCLK] [get_bd_pins signal_selector_SPI_1/SPI_1_SCLK] \
  [get_bd_pins signal_selector_SPI_0/SPI_0_SCLK] [get_bd_pins signal_selector_SPI_1/SPI_0_SCLK]
connect_bd_net [get_bd_pins core_wrapper_0/SPI_SELECT_0] [get_bd_pins signal_selector_SPI_0/select_SPI_1]
connect_bd_net [get_bd_pins core_wrapper_0/SPI_SELECT_1] [get_bd_pins signal_selector_SPI_1/select_SPI_1]
connect_bd_net [get_bd_pins core_wrapper_0/SPI_chip_select] [get_bd_ports SPI_select]
connect_bd_net [get_bd_pins core_wrapper_0/adc_conversion_start] [get_bd_pins xadc_wiz_0/convst_in]
connect_bd_net [get_bd_pins core_wrapper_0/adc_enable] [get_bd_pins xadc_wiz_0/den_in]
connect_bd_net [get_bd_pins core_wrapper_0/adc_programming_out] [get_bd_pins xadc_wiz_0/di_in]
connect_bd_net [get_bd_pins core_wrapper_0/adc_register_address] [get_bd_pins xadc_wiz_0/daddr_in]
connect_bd_net [get_bd_pins core_wrapper_0/adc_write_enable] [get_bd_pins xadc_wiz_0/dwe_in]
connect_bd_net [get_bd_pins core_wrapper_0/address] [get_bd_pins xlconcat_address/In1]
connect_bd_net [get_bd_pins core_wrapper_0/address_extension_latched] [get_bd_pins xlconcat_mem_input_address1/In1]
connect_bd_net [get_bd_pins core_wrapper_0/address_latched] [get_bd_pins xlconcat_mem_input_address1/In0]
connect_bd_net [get_bd_pins core_wrapper_0/bus_clock_or_strobe] [get_bd_ports clock_or_strobe]
connect_bd_net [get_bd_pins core_wrapper_0/bus_data] [get_bd_ports output_bus] [get_bd_pins axi_gpio_core_status_5/gpio_io_i]
connect_bd_net [get_bd_pins core_wrapper_0/clock_cycles_this_run] \
  [get_bd_pins xlslice_clock_cycles_this_run_0/Din] [get_bd_pins xlslice_clock_cycles_this_run_1/Din]
connect_bd_net [get_bd_pins core_wrapper_0/error_detected] [get_bd_pins xlconcat_status/In3]
connect_bd_net [get_bd_pins core_wrapper_0/input_buf_mem_address] \
  [get_bd_pins xlconcat_mem_input_address/In1] [get_bd_pins axi_gpio_core_status_0/gpio2_io_i]
connect_bd_net [get_bd_pins core_wrapper_0/input_buf_mem_data] [get_bd_pins blk_mem_input_data/dinb]
connect_bd_net [get_bd_pins core_wrapper_0/input_buf_mem_write] \
  [get_bd_ports storing_data] [get_bd_pins xlconcat_mem_input_web/In0] [get_bd_pins xlconcat_mem_input_web/In1] \
  [get_bd_pins xlconcat_mem_input_web/In2] [get_bd_pins xlconcat_mem_input_web/In3]
connect_bd_net [get_bd_pins core_wrapper_0/input_mem_PS_PL_interrupt] [get_bd_pins xlconcat_status/In13] [get_bd_pins xlconcat_status1/In2]
connect_bd_net [get_bd_pins core_wrapper_0/int_out] \
  [get_bd_pins xlconcat_status/In7] [get_bd_pins xlconcat_status1/In0] [get_bd_pins processing_system7_0/Core0_nFIQ]
connect_bd_net [get_bd_pins core_wrapper_0/last_DMA_memory_margin] [get_bd_pins axi_gpio_core_status_3/gpio_io_i]
connect_bd_net [get_bd_pins core_wrapper_0/options] \
  [get_bd_pins xlslice_core_options_PL_to_PS/Din] [get_bd_pins xlslice_core_options_LED/Din] \
  [get_bd_pins xlslice_core_options_SPI_select/Din] [get_bd_pins xlslice_core_dig_out/Din] \
  [get_bd_pins xlslice_core_dig_out_bit_7/Din]
connect_bd_net [get_bd_pins core_wrapper_0/running] \
  [get_bd_pins xlconcat_status/In2] [get_bd_pins stop_watch_wrapper_0/running] [get_bd_ports LED_running]
connect_bd_net [get_bd_pins core_wrapper_0/secondary_PS_PL_interrupt] [get_bd_pins xlconcat_status/In9] [get_bd_pins xlconcat_status1/In1]
connect_bd_net [get_bd_pins core_wrapper_0/trigger_out] [get_bd_ports trigger_out]
connect_bd_net [get_bd_pins core_wrapper_0/waiting_for_periodic_trigger] [get_bd_pins xlconcat_status/In4]
connect_bd_net [get_bd_pins core_wrapper_0/warning_missed_periodic_trigger] [get_bd_pins xlconcat_status/In5]
connect_bd_net -net ext_clock_0_1 [get_bd_ports ext_clock_0] [get_bd_pins clk_wiz_10_to_100MHz/clk_in1]
connect_bd_net -net ext_clock_1_1 [get_bd_ports ext_clock_1] [get_bd_pins clk_wiz_ext_selection/clk_in2]
connect_bd_net -net ext_condition_0_1 [get_bd_ports ext_condition_0] [get_bd_pins xlconcat_status/In10] [get_bd_pins core_wrapper_0/condition_0]
connect_bd_net -net ext_condition_1_1 [get_bd_ports ext_condition_1] [get_bd_pins xlconcat_status/In11] [get_bd_pins core_wrapper_0/condition_1]
connect_bd_net -net ext_trigger_0_1 [get_bd_ports ext_trigger_0] [get_bd_pins core_wrapper_0/trigger_0]
connect_bd_net -net ext_trigger_1_1 [get_bd_ports ext_trigger_1] [get_bd_pins core_wrapper_0/trigger_1]
connect_bd_net [get_bd_ports interlock] [get_bd_pins xlconcat_status/In12]
connect_bd_net -net port_MISO_1 [get_bd_ports SPI_0_MISO] [get_bd_pins signal_selector_SPI_0/port_MISO] [get_bd_pins core_wrapper_0/SPI_IN_0]
connect_bd_net -net port_MISO_1_1 [get_bd_ports SPI_1_MISO] [get_bd_pins signal_selector_SPI_1/port_MISO] [get_bd_pins core_wrapper_0/SPI_IN_1]
connect_bd_net -net port_scl_i_1 [get_bd_ports I2C_1_scl_i] [get_bd_pins signal_selector_IIC_1/port_scl_i]
connect_bd_net -net port_scl_i_1_1 [get_bd_ports I2C_0_scl_i] [get_bd_pins signal_selector_IIC_0/port_scl_i]
connect_bd_net -net port_sda_i_1 [get_bd_ports I2C_1_sda_i] [get_bd_pins signal_selector_IIC_1/port_sda_i]
connect_bd_net -net port_sda_i_1_1 [get_bd_ports I2C_0_sda_i] [get_bd_pins signal_selector_IIC_0/port_sda_i]
connect_bd_net [get_bd_pins proc_sys_reset_0/peripheral_aresetn] \
  [get_bd_pins axi_interconnect_0/S00_ARESETN] [get_bd_pins axi_interconnect_0/M00_ARESETN] \
  [get_bd_pins axi_interconnect_0/ARESETN] [get_bd_pins axi_interconnect_0/M01_ARESETN] \
  [get_bd_pins axi_interconnect_0/M02_ARESETN] [get_bd_pins axi_interconnect_0/M03_ARESETN] \
  [get_bd_pins axi_bram_ctrl_0/s_axi_aresetn] [get_bd_pins axi_interconnect_0/M04_ARESETN] \
  [get_bd_pins axi_interconnect_0/M05_ARESETN] [get_bd_pins axi_interconnect_0/M06_ARESETN] \
  [get_bd_pins axi_interconnect_0/M07_ARESETN] [get_bd_pins axi_bram_ctrl_input_data/s_axi_aresetn] \
  [get_bd_pins axi_interconnect_0/M08_ARESETN] [get_bd_pins axi_interconnect_0/M09_ARESETN] \
  [get_bd_pins axi_interconnect_0/M10_ARESETN] [get_bd_pins axi_gpio_core_status_0/s_axi_aresetn] \
  [get_bd_pins axi_gpio_core_status_1/s_axi_aresetn] [get_bd_pins axi_gpio_config_status/s_axi_aresetn] \
  [get_bd_pins axi_gpio_core_status_2/s_axi_aresetn] [get_bd_pins axi_gpio_core_status_3/s_axi_aresetn] \
  [get_bd_pins axi_gpio_core_status_4/s_axi_aresetn] [get_bd_pins axi_gpio_core_status_5/s_axi_aresetn] \
  [get_bd_pins axi_gpio_core_status_6/s_axi_aresetn] [get_bd_pins axi_gpio_stop_watch/s_axi_aresetn] \
  [get_bd_pins axi_interconnect_1/ARESETN] [get_bd_pins axi_interconnect_1/M00_ARESETN] \
  [get_bd_pins axi_interconnect_1/S00_ARESETN]
connect_bd_net [get_bd_pins processing_system7_0/FCLK_CLK0] \
  [get_bd_pins axi_interconnect_0/S00_ACLK] [get_bd_pins axi_interconnect_0/M00_ACLK] [get_bd_pins axi_interconnect_0/ACLK] \
  [get_bd_pins axi_interconnect_0/M01_ACLK] [get_bd_pins axi_interconnect_0/M02_ACLK] \
  [get_bd_pins axi_interconnect_0/M03_ACLK] [get_bd_pins axi_bram_ctrl_0/s_axi_aclk] \
  [get_bd_pins axi_interconnect_0/M04_ACLK] [get_bd_pins axi_interconnect_0/M05_ACLK] \
  [get_bd_pins axi_interconnect_0/M06_ACLK] [get_bd_pins axi_interconnect_0/M07_ACLK] \
  [get_bd_pins axi_bram_ctrl_input_data/s_axi_aclk] [get_bd_pins axi_interconnect_0/M08_ACLK] \
  [get_bd_pins axi_interconnect_0/M09_ACLK] [get_bd_pins axi_interconnect_0/M10_ACLK] \
  [get_bd_pins stop_watch_wrapper_0/clock] [get_bd_pins clock_lock_watcher_0/clock] \
  [get_bd_pins axi_gpio_core_status_0/s_axi_aclk] [get_bd_pins axi_gpio_core_status_1/s_axi_aclk] \
  [get_bd_pins axi_gpio_config_status/s_axi_aclk] [get_bd_pins axi_gpio_core_status_2/s_axi_aclk] \
  [get_bd_pins axi_gpio_core_status_3/s_axi_aclk] [get_bd_pins axi_gpio_core_status_4/s_axi_aclk] \
  [get_bd_pins axi_gpio_core_status_5/s_axi_aclk] [get_bd_pins axi_gpio_core_status_6/s_axi_aclk] \
  [get_bd_pins axi_gpio_stop_watch/s_axi_aclk] [get_bd_pins clk_wiz_core/clk_in2] \
  [get_bd_pins proc_sys_reset_0/slowest_sync_clk] [get_bd_pins processing_system7_0/M_AXI_GP0_ACLK] \
  [get_bd_pins processing_system7_0/S_AXI_HP0_ACLK] [get_bd_pins axi_interconnect_1/ACLK] \
  [get_bd_pins axi_interconnect_1/M00_ACLK] [get_bd_pins axi_interconnect_1/S00_ACLK]
connect_bd_net [get_bd_pins processing_system7_0/FCLK_RESET0_N] [get_bd_pins proc_sys_reset_0/ext_reset_in]
connect_bd_net [get_bd_pins processing_system7_0/I2C0_SCL_O] [get_bd_pins CPU_I2C_0_signal_selector_dest_0/port_scl_o]
connect_bd_net [get_bd_pins processing_system7_0/I2C0_SCL_T] [get_bd_pins CPU_I2C_0_signal_selector_dest_0/port_scl_t]
connect_bd_net [get_bd_pins processing_system7_0/I2C0_SDA_O] [get_bd_pins CPU_I2C_0_signal_selector_dest_0/port_sda_o]
connect_bd_net [get_bd_pins processing_system7_0/I2C0_SDA_T] [get_bd_pins CPU_I2C_0_signal_selector_dest_0/port_sda_t]
connect_bd_net [get_bd_pins processing_system7_0/I2C1_SCL_O] [get_bd_pins signal_selector_IIC_1/IIC_0_scl_o]
connect_bd_net [get_bd_pins processing_system7_0/I2C1_SCL_T] [get_bd_pins signal_selector_IIC_1/IIC_0_scl_t]
connect_bd_net [get_bd_pins processing_system7_0/I2C1_SDA_O] [get_bd_pins signal_selector_IIC_1/IIC_0_sda_o]
connect_bd_net [get_bd_pins processing_system7_0/I2C1_SDA_T] [get_bd_pins signal_selector_IIC_1/IIC_0_sda_t]
connect_bd_net [get_bd_pins signal_selector_IIC_0/IIC_0_scl_i] [get_bd_pins CPU_I2C_0_signal_selector_dest_0/IIC_0_scl_i]
connect_bd_net [get_bd_pins signal_selector_IIC_0/IIC_0_sda_i] [get_bd_pins CPU_I2C_0_signal_selector_dest_0/IIC_0_sda_i]
connect_bd_net [get_bd_pins signal_selector_IIC_0/IIC_1_sda_i] [get_bd_pins core_wrapper_0/I2C_SDA_IN_0]
connect_bd_net [get_bd_pins signal_selector_IIC_0/port_scl_o] [get_bd_ports I2C_0_scl_o]
connect_bd_net [get_bd_pins signal_selector_IIC_0/port_scl_t] [get_bd_ports I2C_0_scl_t]
connect_bd_net [get_bd_pins signal_selector_IIC_0/port_sda_o] [get_bd_ports I2C_0_sda_o]
connect_bd_net [get_bd_pins signal_selector_IIC_0/port_sda_t] [get_bd_ports I2C_0_sda_t]
connect_bd_net [get_bd_pins signal_selector_IIC_1/IIC_0_scl_i] [get_bd_pins processing_system7_0/I2C1_SCL_I]
connect_bd_net [get_bd_pins signal_selector_IIC_1/IIC_0_sda_i] [get_bd_pins processing_system7_0/I2C1_SDA_I]
connect_bd_net [get_bd_pins signal_selector_IIC_1/IIC_1_sda_i] [get_bd_pins core_wrapper_0/I2C_SDA_IN_1]
connect_bd_net [get_bd_pins signal_selector_IIC_1/port_scl_o] [get_bd_ports I2C_1_scl_o]
connect_bd_net [get_bd_pins signal_selector_IIC_1/port_scl_t] [get_bd_ports I2C_1_scl_t]
connect_bd_net [get_bd_pins signal_selector_IIC_1/port_sda_o] [get_bd_ports I2C_1_sda_o]
connect_bd_net [get_bd_pins signal_selector_IIC_1/port_sda_t] [get_bd_ports I2C_1_sda_t]
connect_bd_net [get_bd_pins signal_selector_SPI_0/port_MOSI] [get_bd_ports SPI_0_MOSI]
connect_bd_net [get_bd_pins signal_selector_SPI_0/port_SCLK] [get_bd_ports SPI_0_SCLK]
connect_bd_net [get_bd_pins signal_selector_SPI_1/port_MOSI] [get_bd_ports SPI_1_MOSI]
connect_bd_net [get_bd_pins signal_selector_SPI_1/port_SCLK] [get_bd_ports SPI_1_SCLK]
connect_bd_net -net signal_selector_dest_0_IIC_0_scl_o [get_bd_pins CPU_I2C_0_signal_selector_dest_0/IIC_0_scl_o] \
  [get_bd_pins signal_selector_IIC_0/IIC_0_scl_o]
connect_bd_net -net signal_selector_dest_0_IIC_0_scl_t [get_bd_pins CPU_I2C_0_signal_selector_dest_0/IIC_0_scl_t] \
  [get_bd_pins signal_selector_IIC_0/IIC_0_scl_t]
connect_bd_net -net signal_selector_dest_0_IIC_0_sda_o [get_bd_pins CPU_I2C_0_signal_selector_dest_0/IIC_0_sda_o] \
  [get_bd_pins signal_selector_IIC_0/IIC_0_sda_o]
connect_bd_net -net signal_selector_dest_0_IIC_0_sda_t [get_bd_pins CPU_I2C_0_signal_selector_dest_0/IIC_0_sda_t] \
  [get_bd_pins signal_selector_IIC_0/IIC_0_sda_t]
connect_bd_net -net signal_selector_dest_0_port_scl_i [get_bd_pins CPU_I2C_0_signal_selector_dest_0/port_scl_i] \
  [get_bd_pins processing_system7_0/I2C0_SCL_I]
connect_bd_net -net signal_selector_dest_0_port_sda_i [get_bd_pins CPU_I2C_0_signal_selector_dest_0/port_sda_i] \
  [get_bd_pins processing_system7_0/I2C0_SDA_I]
connect_bd_net [get_bd_pins stop_watch_wrapper_0/counter] [get_bd_pins xlslice_stop_watch_low/Din] [get_bd_pins xlslice_stop_watch_low1/Din]
connect_bd_net [get_bd_ports uart_rtl_0_sin] [get_bd_ports uart_rtl_0_sout]
connect_bd_net [get_bd_pins util_vector_logic_0/Res] [get_bd_pins xlconcat_address1/In1]
connect_bd_net [get_bd_pins xadc_wiz_0/channel_out] [get_bd_pins core_wrapper_0/adc_channel]
connect_bd_net [get_bd_pins xadc_wiz_0/do_out] [get_bd_pins core_wrapper_0/adc_result_in]
connect_bd_net [get_bd_pins xadc_wiz_0/drdy_out] [get_bd_pins core_wrapper_0/adc_ready]
connect_bd_net -net xlconcat_1_dout [get_bd_pins xlconcat_status/dout] [get_bd_pins axi_gpio_config_status/gpio2_io_i]
connect_bd_net [get_bd_pins xlconcat_address1/dout] [get_bd_ports core_dig_out]
connect_bd_net [get_bd_pins xlconcat_address/dout] [get_bd_pins blk_mem_gen_0/addrb]
connect_bd_net [get_bd_pins xlconcat_mem_input_address1/dout] [get_bd_pins axi_gpio_core_status_0/gpio_io_i]
connect_bd_net -net xlconcat_mem_input_address2_dout [get_bd_pins xlconcat_mem_input_web/dout] [get_bd_pins blk_mem_input_data/web]
connect_bd_net [get_bd_pins xlconcat_mem_input_address/dout] [get_bd_pins blk_mem_input_data/addrb]
connect_bd_net [get_bd_pins xlconcat_status1/dout] [get_bd_pins processing_system7_0/IRQ_F2P]
connect_bd_net [get_bd_pins xlconstant_1/dout] [get_bd_pins blk_mem_gen_0/web]
connect_bd_net [get_bd_pins xlconstant_5/dout] [get_bd_pins xlconcat_address/In2]
connect_bd_net [get_bd_pins xlconstant_6/dout] [get_bd_pins xlconcat_address/In0]
connect_bd_net [get_bd_pins xlconstant_7/dout] \
  [get_bd_pins signal_selector_IIC_0/IIC_1_scl_t] [get_bd_pins signal_selector_IIC_0/IIC_1_sda_t] \
  [get_bd_pins signal_selector_IIC_1/IIC_1_scl_t] [get_bd_pins signal_selector_IIC_1/IIC_1_sda_t]
connect_bd_net -net xlconstant_mem_input_addr_high1_dout [get_bd_pins xlconstant_address_replacement/dout] \
  [get_bd_pins axi_gpio_core_status_3/gpio2_io_i]
connect_bd_net -net xlconstant_mem_input_addr_low1_dout [get_bd_pins xlconstant_mem_input_addr_high/dout] [get_bd_pins xlconcat_mem_input_address/In2]
connect_bd_net [get_bd_pins xlconstant_mem_input_addr_low/dout] [get_bd_pins xlconcat_mem_input_address/In0]
connect_bd_net [get_bd_pins xlslice_clock_cycles_this_run_0/Dout] [get_bd_pins axi_gpio_core_status_6/gpio_io_i]
connect_bd_net [get_bd_pins xlslice_clock_cycles_this_run_1/Dout] [get_bd_pins axi_gpio_core_status_6/gpio2_io_i]
connect_bd_net -net xlslice_clock_cycles_this_run_2_Dout [get_bd_pins xlslice_core_options_PL_to_PS/Dout] \
  [get_bd_pins axi_gpio_core_status_5/gpio2_io_i]
connect_bd_net [get_bd_pins xlslice_core_dig_out/Dout] [get_bd_pins xlconcat_address1/In0]
connect_bd_net [get_bd_pins xlslice_core_dig_out_bit_7/Dout] [get_bd_pins util_vector_logic_0/Op2]
connect_bd_net [get_bd_pins xlslice_core_options_LED/Dout] [get_bd_ports core_options_LED_0]
connect_bd_net [get_bd_pins xlslice_periodic_trigger_count_0/Dout] [get_bd_pins axi_gpio_core_status_2/gpio_io_i]
connect_bd_net [get_bd_pins xlslice_periodic_trigger_count_1/Dout] [get_bd_pins axi_gpio_core_status_2/gpio2_io_i]
connect_bd_net [get_bd_pins xlslice_periodic_trigger_count_2/Dout] [get_bd_pins axi_gpio_core_status_4/gpio_io_i]
connect_bd_net [get_bd_pins xlslice_periodic_trigger_count_3/Dout] [get_bd_pins axi_gpio_core_status_4/gpio2_io_i]
connect_bd_net [get_bd_pins xlslice_stop_watch_low1/Dout] [get_bd_pins axi_gpio_stop_watch/gpio2_io_i]
connect_bd_net [get_bd_pins xlslice_stop_watch_low/Dout] [get_bd_pins axi_gpio_stop_watch/gpio_io_i]
connect_bd_net [get_bd_pins xlslice_wait_cycles_0/Dout] [get_bd_pins axi_gpio_core_status_1/gpio_io_i]
connect_bd_net [get_bd_pins xlslice_wait_cycles_1/Dout] [get_bd_pins axi_gpio_core_status_1/gpio2_io_i]
set_property HDL_ATTRIBUTE.BMM_INFO_ADDRESS_SPACE {byte  0x40000000 64 > design_1 blk_mem_gen_0} [get_bd_cells axi_bram_ctrl_0]
set_property HDL_ATTRIBUTE.KEEP_HIERARCHY yes [get_bd_cells axi_bram_ctrl_0]
set_property HDL_ATTRIBUTE.BMM_INFO_ADDRESS_SPACE {byte  0x42000000 32 > design_1 blk_mem_input_data} [get_bd_cells axi_bram_ctrl_input_data]
set_property HDL_ATTRIBUTE.KEEP_HIERARCHY yes [get_bd_cells axi_bram_ctrl_input_data]
set_property HDL_ATTRIBUTE.BMM_INFO_PROCESSOR {arm > design_1 axi_bram_ctrl_0 design_1 axi_bram_ctrl_input_data} [get_bd_cells processing_system7_0]
set_property HDL_ATTRIBUTE.KEEP_HIERARCHY yes [get_bd_cells processing_system7_0]
